# EAGLE schematic tc083-18 (EAGLE 6.6.0), part 1 of 2

## Sheet 1 of 12
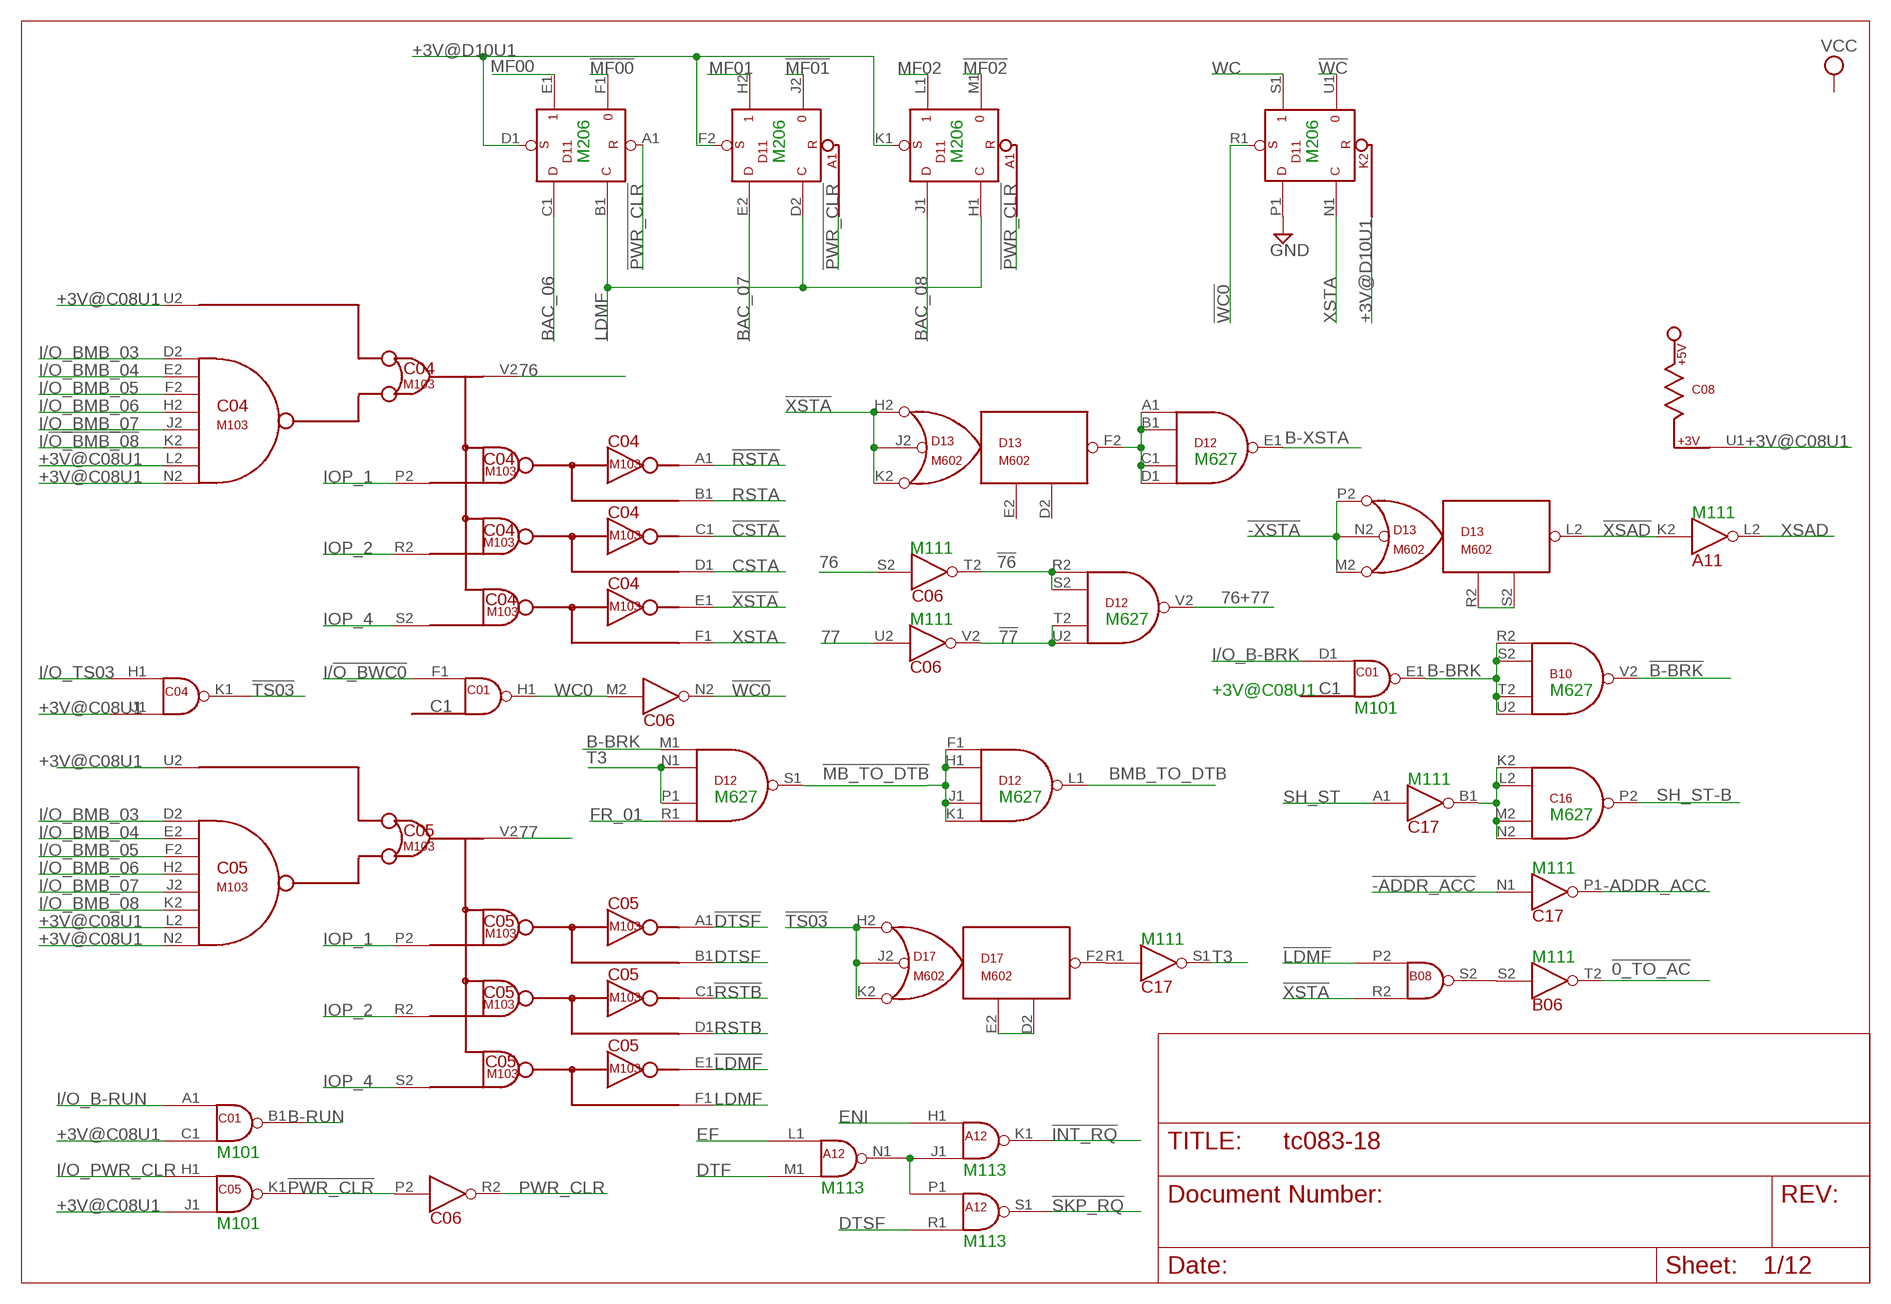
[diagram p0: schematic, sheet 1]

### Parts
A11  A11  M111  [H807]
A12  A12  M113  [H807]
B06  B06  M111  [H807]
B08  B08  M113  [H807]
B10  B10  M627  [H807]
C01  C01  M101  [H807]
C04  C04  M103  [H807]
C05  C05  M103  [H807]
C06  C06  M111  [H807]
C08  C08  M121  [H807]
C16  C16  M627  [H807]
C17  C17  M111  [H807]
D11  M206X  [H807]
D12  D12  M627  [H807]
D13  D13  M602  [H807]
D17  D17  M602  [H807]

### Nets
76: C04.V2 C06.S2(15:IN)
76+77: D12.V2(OUT) ; also sheet 11
77: C05.V2 C06.U2(16:IN)
!0_TO_AC: B06.T2(15:OUT) ; also sheet 11
!76: C06.T2(15:OUT) D12.R2(IN1) D12.S2(IN2)
!77: C06.V2(16:OUT) D12.T2(IN3) D12.U2(IN4)
!-ADDR_ACC: C17.N1(10:IN) ; also sheet 11
!-XSTA: D13.M2(K2) D13.N2(J2) D13.P2(H2)
!B-BRK: B10.V2(OUT) ; also sheet 11
!CSTA: C04.C1 ; also sheet 2
!DTSF: C05.A1
!INT_RQ: A12.K1(OUT) ; also sheet 11
!LDMF: B08.P2(IN1) C05.E1
!MB_TO_DTB: D12.F1(IN1) D12.H1(IN2) D12.J1(IN3) D12.K1(IN4) D12.S1(OUT)
!MF00: D11.F1 ; also sheet 11
!MF01: D11.J2 ; also sheet 11
!MF02: D11.M1 ; also sheet 11
!PWR_CLR: C05.K1(OUT) C06.P2(13:IN) D11.A1(A1:R) ; also sheet 2,4,5,6
!RSTA: C04.A1 ; also sheet 11
!RSTB: C05.C1 ; also sheet 11
!SKP_RQ: A12.S1(OUT) ; also sheet 11
!TS03: C04.K1(OUT) D17.H2 D17.J2 D17.K2
!WC: D11.U1 ; also sheet 4
!WC0: C06.N2(11:OUT) D11.R1(K2B:S)
!XSAD: A11.K2(9:IN) D13.L2(F2)
!XSTA: B08.R2(IN2) C04.E1 D13.H2 D13.J2 D13.K2 ; also sheet 3,6
+3V@C08U1: C01.C1(IN2) C04.J1(IN2) C04.L2 C04.N2 C04.U2 C05.J1(IN2) C05.L2 C05.N2 C05.U2 C08.U1 ; also sheet 11
+3V@D10U1: D11.D1(A1:S) D11.F2(A1B:S) D11.K1(A1C:S) ; also sheet 3,4
-ADDR_ACC: C17.P1(10:OUT)
B-BRK: B10.R2(IN1) B10.S2(IN2) B10.T2(IN3) B10.U2(IN4) C01.E1(OUT) D12.M1(IN1)
B-RUN: C01.B1(OUT) ; also sheet 2
B-XSTA: D12.E1(OUT) ; also sheet 4,6
BAC_06: D11.C1(A1:D) ; also sheet 2,10
BAC_07: D11.E2(A1B:D) ; also sheet 2,10
BAC_08: D11.J1(A1C:D) ; also sheet 2,10
BMB_TO_DTB: D12.L1(OUT) ; also sheet 8
CSTA: C04.D1 ; also sheet 6
DTF: A12.M1(IN2) ; also sheet 4,6,12
DTSF: A12.R1(IN2) C05.B1
EF: A12.L1(IN1) ; also sheet 6,12
ENI: A12.H1(IN1) ; also sheet 2,12
FR_01: D12.R1(IN4) ; also sheet 2,5,6,12
GND: D11.P1(K2B:D) ; also sheet 2,4,10,11,12
I/!O_BMB_08: C04.K2 ; also sheet 12
I/!O_BWC0: C01.F1(IN) ; also sheet 12
I/O_B-BRK: C01.D1(IN) ; also sheet 12
I/O_B-RUN: C01.A1(IN1) ; also sheet 12
I/O_BMB_03: C04.D2 C05.D2 ; also sheet 11,12
I/O_BMB_04: C04.E2 C05.E2 ; also sheet 11,12
I/O_BMB_05: C04.F2 C05.F2 ; also sheet 11,12
I/O_BMB_06: C04.H2 C05.H2 ; also sheet 11,12
I/O_BMB_07: C04.J2 C05.J2 ; also sheet 11,12
I/O_BMB_08: C05.K2 ; also sheet 11,12
I/O_PWR_CLR: C05.H1(IN1) ; also sheet 12
I/O_TS03: C04.H1(IN1) ; also sheet 12
IOP_1: C04.P2 C05.P2 ; also sheet 12
IOP_2: C04.R2 C05.R2 ; also sheet 12
IOP_4: C04.S2 C05.S2 ; also sheet 12
LDMF: C05.F1 D11.B1(A1:C) D11.D2(A1B:C) D11.H1(A1C:C)
MF00: D11.E1 ; also sheet 12
MF01: D11.H2 ; also sheet 12
MF02: D11.L1 ; also sheet 12
N$1: B06.S2(15:IN) B08.S2(OUT)
N$2: C16.K2(IN1) C16.L2(IN2) C16.M2(IN3) C16.N2(IN4) C17.B1(1:OUT)
N$4: D13.R2(E2) D13.S2(D2)
N$6: D12.A1(IN1) D12.B1(IN2) D12.C1(IN3) D12.D1(IN4) D13.F2
N$7: A12.J1(IN2) A12.N1(OUT) A12.P1(IN1)
N$8: C17.R1(12:IN) D17.F2
N$12: D17.D2 D17.E2
PWR_CLR: C06.R2(13:OUT)
RSTA: C04.B1
RSTB: C05.D1
SH_ST: C17.A1(1:IN) ; also sheet 7
SH_ST-B: C16.P2(OUT) ; also sheet 7
T3: C17.S1(12:OUT) D12.N1(IN2) D12.P1(IN3)
WC: D11.S1 ; also sheet 4,5,12
WC0: C01.H1(OUT) C06.M2(11:IN)
XSAD: A11.L2(9:OUT) ; also sheet 6
XSTA: C04.F1 D11.N1(K2B:C) ; also sheet 2
Unconnected: A12.U1 A12.V1 B06.M2(11:IN) B06.N2(11:OUT) B06.U2(16:IN) B06.V2(16:OUT) B08.U1 B10.K2(IN1) B10.L2(IN2) B10.M2(IN3) B10.N2(IN4) B10.P2(OUT) C01.E2(IN) C01.F2(OUT) C01.H2(IN) C01.J1(IN) C01.J2(OUT) C01.K1(OUT) C01.K2(IN) C01.L1(IN) C01.L2(OUT) C01.M1(OUT) C01.M2(IN) C01.N1(IN) C01.N2(OUT) C01.P1(OUT) C01.P2(IN) C01.R1(IN) C01.R2(OUT) C01.S1(OUT) C01.S2(IN) C01.T2(OUT) C01.U1(OUT) C01.U2(IN) C01.V1(IN) C01.V2(OUT) C04.L1(IN1) C04.M1(IN2) C04.N1(OUT) C05.L1(IN1) C05.M1(IN2) C05.N1(OUT) C08.V1 C17.D1(3:IN) C17.E1(3:OUT) C17.K2(9:IN) C17.L2(9:OUT) C17.U2(16:IN) C17.V2(16:OUT) D13.D2 D13.E2

### Notes on the sheet
- M206 | M206 | M206 | M206
- M627
- M111
- M111
- M111 | M627
- +3V@C08U1 | M627
- M101
- M111
- M627 | M627
- M627
- M111
- M111
- M111
- M101
- M113
- M113
- M101
- M113

## Sheet 2 of 12
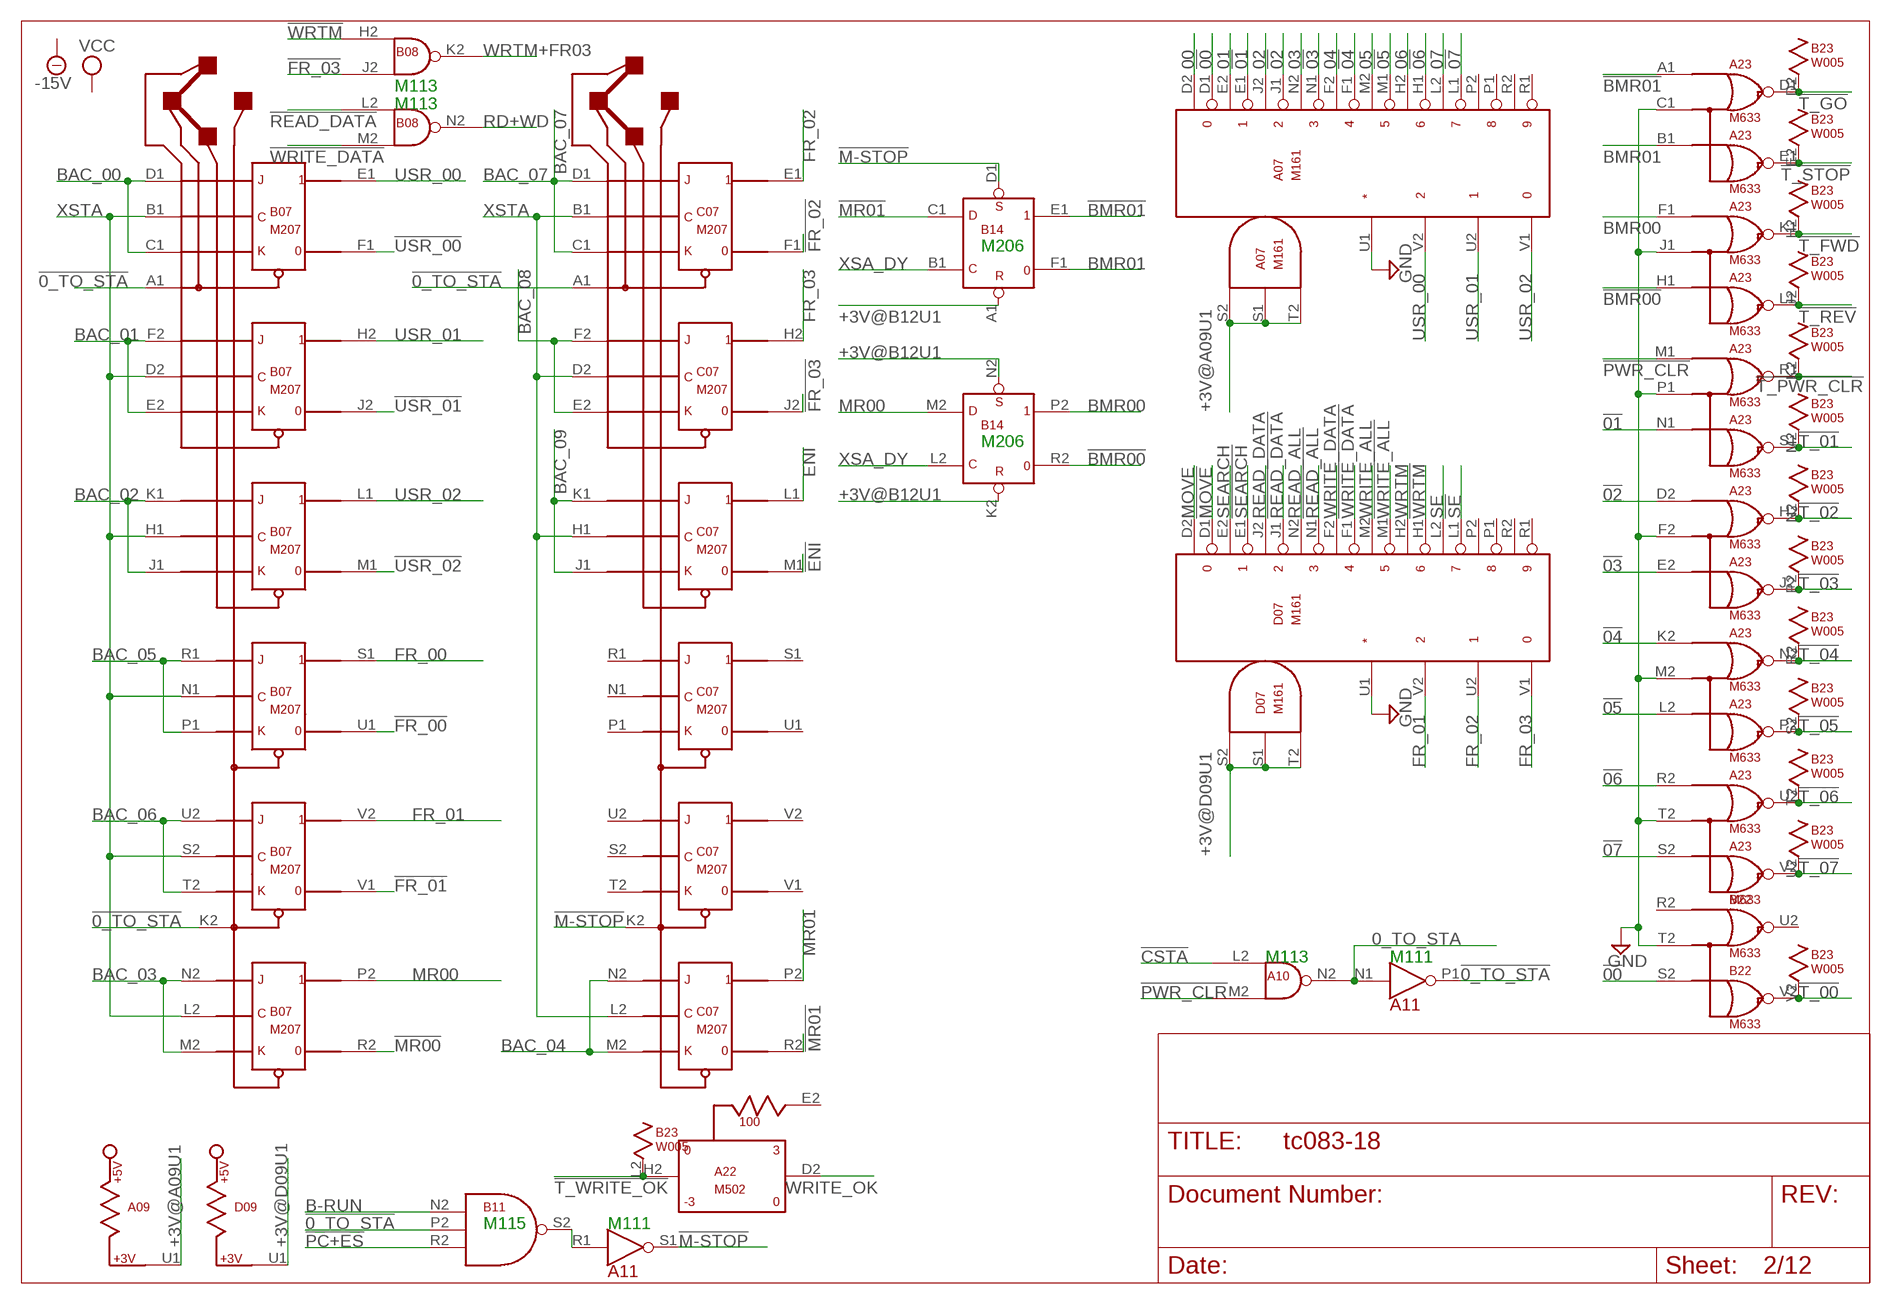
[diagram p1: schematic, sheet 2]

### Parts
A07  A07  M161  [H807]
A09  M117  [H807]
A10  M113  [H807]
A22  M502  [H807]
A23  M633  [H807]
B07  B07  M207  [H807]
B11  M115  [H807]
B14  M206X  [H807]
B22  M633  [H807]
B23  W005  [H807]
C07  B07  M207  [H807]
D07  D07  M161  [H807]
D09  M121  [H807]

### Nets
00: A07.D2(O0)
0_TO_STA: A10.N2(OUT) A11.N1(10:IN)
01: A07.E2(O1)
02: A07.J2(O2)
03: A07.N2(O3)
04: A07.F2(O4)
05: A07.M2(O5)
06: A07.H2(O6)
07: A07.L2(O7)
!00: A07.D1(!O0) B22.S2(B)
!0_TO_STA: A11.P1(10:OUT) B07.A1 B07.K2 B11.P2(IN2) C07.A1
!01: A07.E1(!O1) A23.N1(B)
!02: A07.J1(!O2) A23.D2(A)
!03: A07.N1(!O3) A23.E2(B)
!04: A07.F1(!O4) A23.K2(A)
!05: A07.M1(!O5) A23.L2(B)
!06: A07.H1(!O6) A23.R2(A)
!07: A07.L1(!O7) A23.S2(B)
!BMR00: A23.H1(B) B14.R2
!BMR01: A23.A1(A) B14.E1
!CSTA: A10.L2(IN1) ; also sheet 1
!ENI: C07.M1 ; also sheet 11
!FR_00: B07.U1 ; also sheet 4,11
!FR_01: B07.V1 ; also sheet 5,11
!FR_02: C07.F1 ; also sheet 11
!FR_03: B08.J2(IN2) C07.J2 ; also sheet 11
!M-STOP: A11.S1(12:OUT) B14.D1(A1:S) C07.K2 ; also sheet 3
!MOVE: D07.D1(!O0)
!MR00: B07.R2 ; also sheet 11
!MR01: B14.C1(A1:D) C07.R2 ; also sheet 11
!PC+ES: B11.R2(IN3) ; also sheet 6
!PWR_CLR: A10.M2(IN2) A23.M1(A) ; also sheet 1,4,5,6
!READ_ALL: D07.N1(!O3) ; also sheet 4
!READ_DATA: B08.L2(IN1) D07.J1(!O2) ; also sheet 5
!SE: D07.L1(!O7) ; also sheet 6
!SEARCH: D07.E1(!O1) ; also sheet 5,11
!T_00: B22.V2(E) B23.V2 ; also sheet 12
!T_01: A23.S1(E) B23.M2 ; also sheet 12
!T_02: A23.H2(D) B23.N2 ; also sheet 12
!T_03: A23.J2(E) B23.P2 ; also sheet 12
!T_04: A23.N2(D) B23.R2 ; also sheet 12
!T_05: A23.P2(E) B23.S2 ; also sheet 12
!T_06: A23.U2(D) B23.T2 ; also sheet 12
!T_07: A23.V2(E) B23.U2 ; also sheet 12
!T_FWD: A23.K1(D) B23.H2 ; also sheet 12
!T_GO: A23.D1(D) B23.D2 ; also sheet 12
!T_PWR_CLR: A23.R1(D) B23.K2 ; also sheet 12
!T_REV: A23.L1(E) B23.J2 ; also sheet 12
!T_STOP: A23.E1(E) B23.E2 ; also sheet 12
!T_WRITE_OK: A22.H2 B23.L2 ; also sheet 12
!USR_00: B07.F1 ; also sheet 11
!USR_01: B07.J2 ; also sheet 11
!USR_02: B07.M1 ; also sheet 11
!WRITE_ALL: D07.M1(!O5)
!WRITE_DATA: B08.M2(IN2) D07.F1(!O4)
!WRTM: B08.H2(IN1) D07.H1(!O6)
+3V@A09U1: A07.S1(EN2) A07.S2(EN1) A07.T2(EN3) A09.U1 ; also sheet 4,6
+3V@B12U1: B14.A1(A1:R) B14.K2(K2:R) B14.N2(K2:S) ; also sheet 3,4
+3V@D09U1: D07.S1(EN2) D07.S2(EN1) D07.T2(EN3) D09.U1
B-RUN: B11.N2(IN1) ; also sheet 1
BAC_00: B07.C1 B07.D1 ; also sheet 10
BAC_01: B07.E2 B07.F2 ; also sheet 10
BAC_02: B07.J1 B07.K1 ; also sheet 10
BAC_03: B07.M2 B07.N2 ; also sheet 10
BAC_04: C07.M2 C07.N2 ; also sheet 10
BAC_05: B07.P1 B07.R1 ; also sheet 10
BAC_06: B07.T2 B07.U2 ; also sheet 1,10
BAC_07: C07.C1 C07.D1 ; also sheet 1,10
BAC_08: C07.E2 C07.F2 ; also sheet 1,10
BAC_09: C07.J1 C07.K1 ; also sheet 10
BMR00: A23.F1(A) B14.P2
BMR01: A23.B1(B) B14.F1
ENI: C07.L1 ; also sheet 1,12
FR_00: B07.S1 ; also sheet 4,12
FR_01: B07.V2 D07.V2(IN2) ; also sheet 1,5,6,12
FR_02: C07.E1 D07.U2(IN1) ; also sheet 12
FR_03: C07.H2 D07.V1(IN0) ; also sheet 5,12
GND: A07.U1(IN*) A23.C1(C) A23.F2(C) A23.J1(C) A23.M2(C) A23.P1(C) A23.T2(C) B22.T2(C) D07.U1(IN*) ; also sheet 1,4,10,11,12
MOVE: D07.D2(O0)
MR00: B07.P2 B14.M2(K2:D) ; also sheet 12
MR01: C07.P2 ; also sheet 3,12
N$3: A11.R1(12:IN) B11.S2(OUT)
RD+WD: B08.N2(OUT) ; also sheet 4,6
READ_ALL: D07.N2(O3)
READ_DATA: D07.J2(O2) ; also sheet 4,6
SE: D07.L2(O7)
SEARCH: D07.E2(O1) ; also sheet 4
USR_00: A07.V2(IN2) B07.E1 ; also sheet 12
USR_01: A07.U2(IN1) B07.H2 ; also sheet 12
USR_02: A07.V1(IN0) B07.L1 ; also sheet 12
WRITE_ALL: D07.M2(O5) ; also sheet 4,5
WRITE_DATA: D07.F2(O4) ; also sheet 5,9
WRITE_OK: A22.D2 ; also sheet 5,6
WRTM: D07.H2(O6) ; also sheet 3,5,6
WRTM+FR03: B08.K2(OUT) ; also sheet 4
XSA_DY: B14.B1(A1:C) B14.L2(K2:C) ; also sheet 6
XSTA: B07.B1 B07.D2 B07.H1 B07.L2 B07.N1 B07.S2 C07.B1 C07.D2 C07.H1 C07.L2 ; also sheet 1
Unconnected: A07.P1(!O8) A07.P2(O8) A07.R1(!O9) A07.R2(O9) A09.V1 A10.U1 A10.V1 A22.E2 A22.P2(E2) A22.R2(D2) A22.U2(H2) B14.D2(A1B:C) B14.E2(A1B:D) B14.F2(A1B:S) B14.H1(A1C:C) B14.H2 B14.J1(A1C:D) B14.J2 B14.K1(A1C:S) B14.L1 B14.M1 B22.A1(A) B22.B1(B) B22.C1(C) B22.D1(D) B22.D2(A) B22.E1(E) B22.E2(B) B22.F1(A) B22.F2(C) B22.H1(B) B22.H2(D) B22.J1(C) B22.J2(E) B22.K1(D) B22.K2(A) B22.L1(E) B22.L2(B) B22.M1(A) B22.M2(C) B22.N1(B) B22.N2(D) B22.P1(C) B22.P2(E) B22.R1(D) B22.R2(A) B22.S1(E) B22.U2(D) B23.F2 C07.N1 C07.P1 C07.R1 C07.S1 C07.S2 C07.T2 C07.U1 C07.U2 C07.V1 C07.V2 D07.P1(!O8) D07.P2(O8) D07.R1(!O9) D07.R2(O9) D09.V1

### Notes on the sheet
- M113
- M113
- M206
- M206
- M113 | M111
- M115 | M111

## Sheet 3 of 12
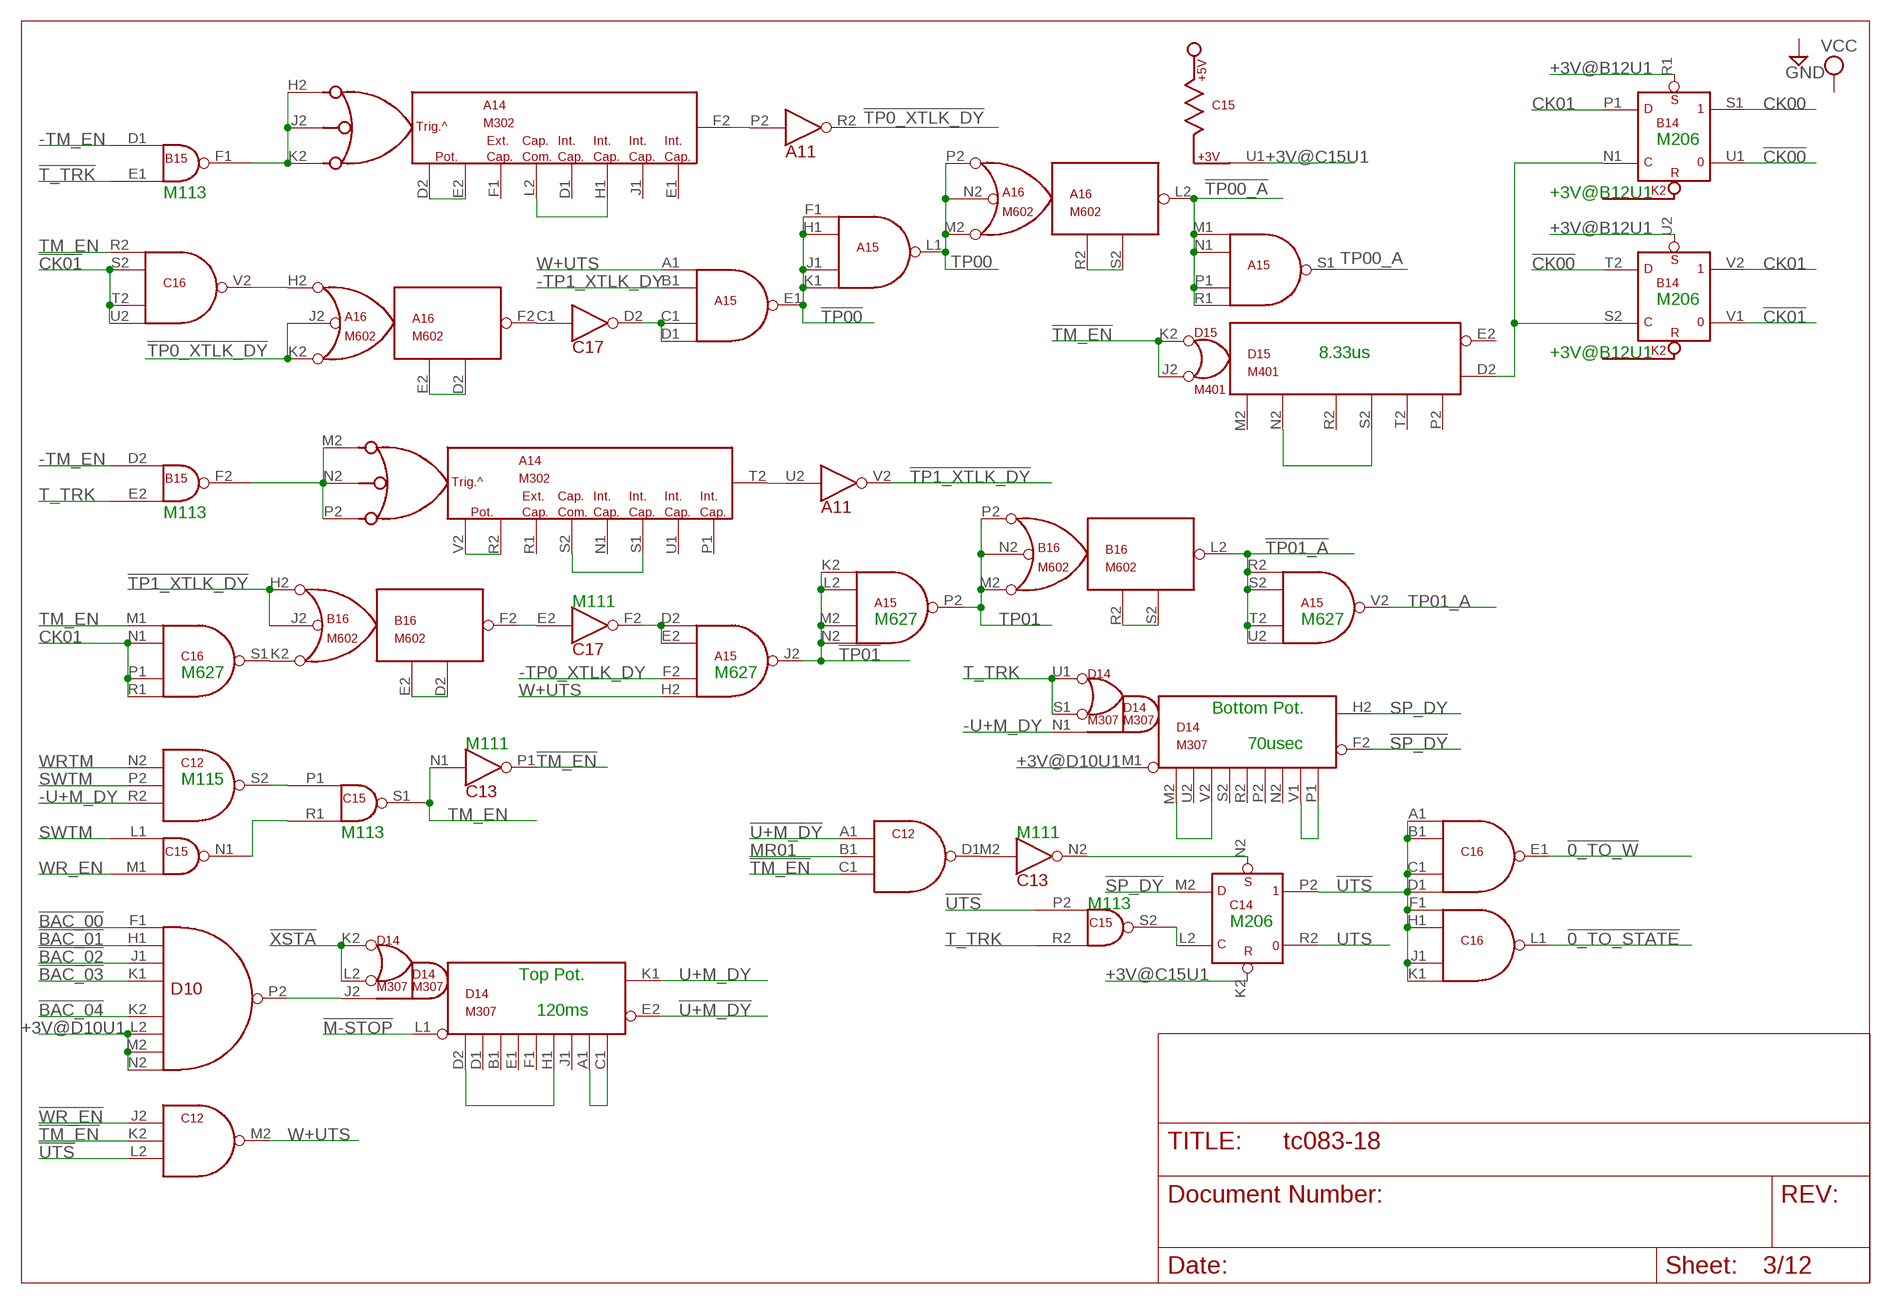
[diagram p2: schematic, sheet 3]

### Parts
A14  M302  [H807]
A15  M627  [H807]
A16  M602  [H807]
B15  M113  [H807]
B16  M602  [H807]
C12  M115  [H807]
C13  M111  [H807]
C14  M206X  [H807]
C15  M113  [H807]
D10  M119  [H807]
D14  M307  [H807]
D15  M401  [H807]

### Nets
!0_TO_STATE: C16.L1(OUT) ; also sheet 7
!0_TO_W: C16.E1(OUT) ; also sheet 7
!BAC_00: D10.F1(IN1) ; also sheet 10,11
!BAC_01: D10.H1(IN2) ; also sheet 10,11
!BAC_02: D10.J1(IN3) ; also sheet 10,11
!BAC_03: D10.K1(IN4) ; also sheet 10,11
!BAC_04: D10.K2(IN5) ; also sheet 10,11
!CK00: B14.T2(K2C:D) B14.U1 ; also sheet 10
!CK01: B14.V1 C16.S2(IN2) C16.T2(IN3) C16.U2(IN4)
!M-STOP: D14.L1(M1) ; also sheet 2
!SP_DY: C14.M2(K2:D) D14.F2
!T_TRK: B15.E1(IN2) ; also sheet 10
!TM_EN: C12.C1(IN3) C12.K2(IN2) C13.P1(10:OUT) D15.J2 D15.K2
!TP00: A15.E1(OUT) A15.F1(IN1) A15.H1(IN2) A15.J1(IN3) A15.K1(IN4) ; also sheet 7
!TP00_A: A15.M1(IN1) A15.N1(IN2) A15.P1(IN3) A15.R1(IN4) A16.L2(F2)
!TP0_XTLK_DY: A11.R2(13:OUT) A16.J2 A16.K2
!TP01: A15.J2(OUT) A15.K2(IN1) A15.L2(IN2) A15.M2(IN3) A15.N2(IN4)
!TP01_A: A15.R2(IN1) A15.S2(IN2) A15.T2(IN3) A15.U2(IN4) B16.L2(F2)
!TP1_XTLK_DY: A11.V2(16:OUT) B16.H2 B16.J2
!U+M_DY: C12.A1(IN1) D14.E2(F2)
!UTS: C12.L2(IN3) C14.P2 C15.P2(IN1) C16.A1(IN1) C16.B1(IN2) C16.C1(IN3) C16.D1(IN4) C16.F1(IN1) C16.H1(IN2) C16.J1(IN3) C16.K1(IN4)
!WR_EN: C12.J2(IN1) ; also sheet 5,9
!XSTA: D14.K2(U1) D14.L2(S1) ; also sheet 1,6
+3V@B12U1: B14.R1(K2B:S) B14.U2(K2C:S) ; also sheet 2,4
+3V@C15U1: C14.K2(K2:R) C15.U1 ; also sheet 5,8
+3V@D10U1: D10.L2(IN6) D10.M2(IN7) D10.N2(IN8) D14.M1 ; also sheet 1,4
-TM_EN: B15.D1(IN1) B15.D2(IN1)
-TP0_XTLK_DY: A15.F2(IN3)
-TP1_XTLK_DY: A15.B1(IN2)
-U+M_DY: C12.R2(IN3) D14.N1
CK00: B14.S1 ; also sheet 10
CK01: B14.P1(K2B:D) B14.V2 C16.N1(IN2) C16.P1(IN3) C16.R1(IN4)
MR01: C12.B1(IN2) ; also sheet 2,12
N$5: A16.H2 C16.V2(OUT)
N$13: A14.H2 A14.J2 A14.K2 B15.F1(OUT)
N$14: A16.D2 A16.E2
N$15: A16.F2 C17.C1(2:IN)
N$16: A15.C1(IN3) A15.D1(IN4) C17.D2(2:OUT)
N$17: B14.N1(K2B:C) B14.S2(K2C:C) D15.D2
N$18: A14.M2(H2) A14.N2(J2) A14.P2(K2) B15.F2(OUT)
N$19: A14.H1 A14.L2
N$20: A16.R2(E2) A16.S2(D2)
N$21: A14.D2 A14.E2
N$22: A11.U2(16:IN) A14.T2(F2)
N$23: A11.P2(13:IN) A14.F2
N$24: B16.K2 C16.S1(OUT)
N$25: A14.R2(E2) A14.V2(D2)
N$26: A14.S1(H1) A14.S2(L2)
N$27: D15.N2 D15.S2
N$29: B16.D2 B16.E2
N$30: B16.F2 C17.E2(5:IN)
N$31: A15.D2(IN1) A15.E2(IN2) C17.F2(5:OUT)
N$37: B16.R2(E2) B16.S2(D2)
N$40: D14.M2 D14.V2
N$41: D14.P1 D14.V1
N$50: C12.S2(OUT) C15.P1(IN1)
N$53: C15.N1(OUT) C15.R1(IN2)
N$67: D10.P2(OUT) D14.J2(N1)
N$68: D14.D2(M2) D14.H1(P2)
N$69: D14.A1(V1) D14.C1(P1)
N$76: C14.L2(K2:C) C15.S2(OUT)
N$79: C13.N2(11:OUT) C14.N2(K2:S)
N$81: C12.D1(OUT) C13.M2(11:IN)
SP_DY: D14.H2
SWTM: C12.P2(IN2) C15.L1(IN1) ; also sheet 5,6,12
T_TRK: B15.E2(IN2) C15.R2(IN2) D14.S1 D14.U1 ; also sheet 10
TM_EN: C13.N1(10:IN) C15.S1(OUT) C16.M1(IN1) C16.R2(IN1) ; also sheet 10
TP00: A15.L1(OUT) A16.M2(K2) A16.N2(J2) A16.P2(H2) ; also sheet 4,5,6
TP00_A: A15.S1(OUT) ; also sheet 5,9
TP01: A15.P2(OUT) B16.M2(K2) B16.N2(J2) B16.P2(H2) ; also sheet 5,7,9
TP01_A: A15.V2(OUT) ; also sheet 4,9
U+M_DY: D14.K1(H2)
UTS: C14.R2 ; also sheet 5,12
W+UTS: A15.A1(IN1) A15.H2(IN4) C12.M2(OUT)
WR_EN: C15.M1(IN2) ; also sheet 5,9,10,12
WRTM: C12.N2(IN1) ; also sheet 2,5,6
Unconnected: A14.D1 A14.E1 A14.F1 A14.J1 A14.N1(D1) A14.P1(E1) A14.R1(F1) A14.U1(J1) B15.A1(IN1) B15.B1(IN2) B15.C1(OUT) B15.H2(IN1) B15.J2(IN2) B15.K2(OUT) B15.L2(IN1) B15.M2(IN2) B15.N2(OUT) B15.T2(IN1) B15.U1 B15.U2(IN2) B15.V1 B15.V2(OUT) C13.U2(16:IN) C13.V2(16:OUT) C14.S2(K2C:C) C14.T2(K2C:D) C14.U2(K2C:S) C14.V1 C14.V2 C15.T2(IN1) C15.U2(IN2) C15.V1 C15.V2(OUT) D10.V1 D14.B1(V2) D14.D1(U2) D14.E1(S2) D14.F1(R2) D14.J1(N2) D14.N2 D14.P2 D14.R2 D14.S2 D14.U2 D15.E2 D15.M2 D15.P2 D15.R2 D15.T2

### Notes on the sheet
- M206
- M113 | +3V@B12U1
- M206
- 8.33us | +3V@B12U1
- M113
- M111
- M627 | M627
- M627 | M627
- Bottom Pot.
- M111 | 70usec
- M115
- M113 | M111
- M113
- M206
- Top Pot.
- 120ms

## Sheet 4 of 12
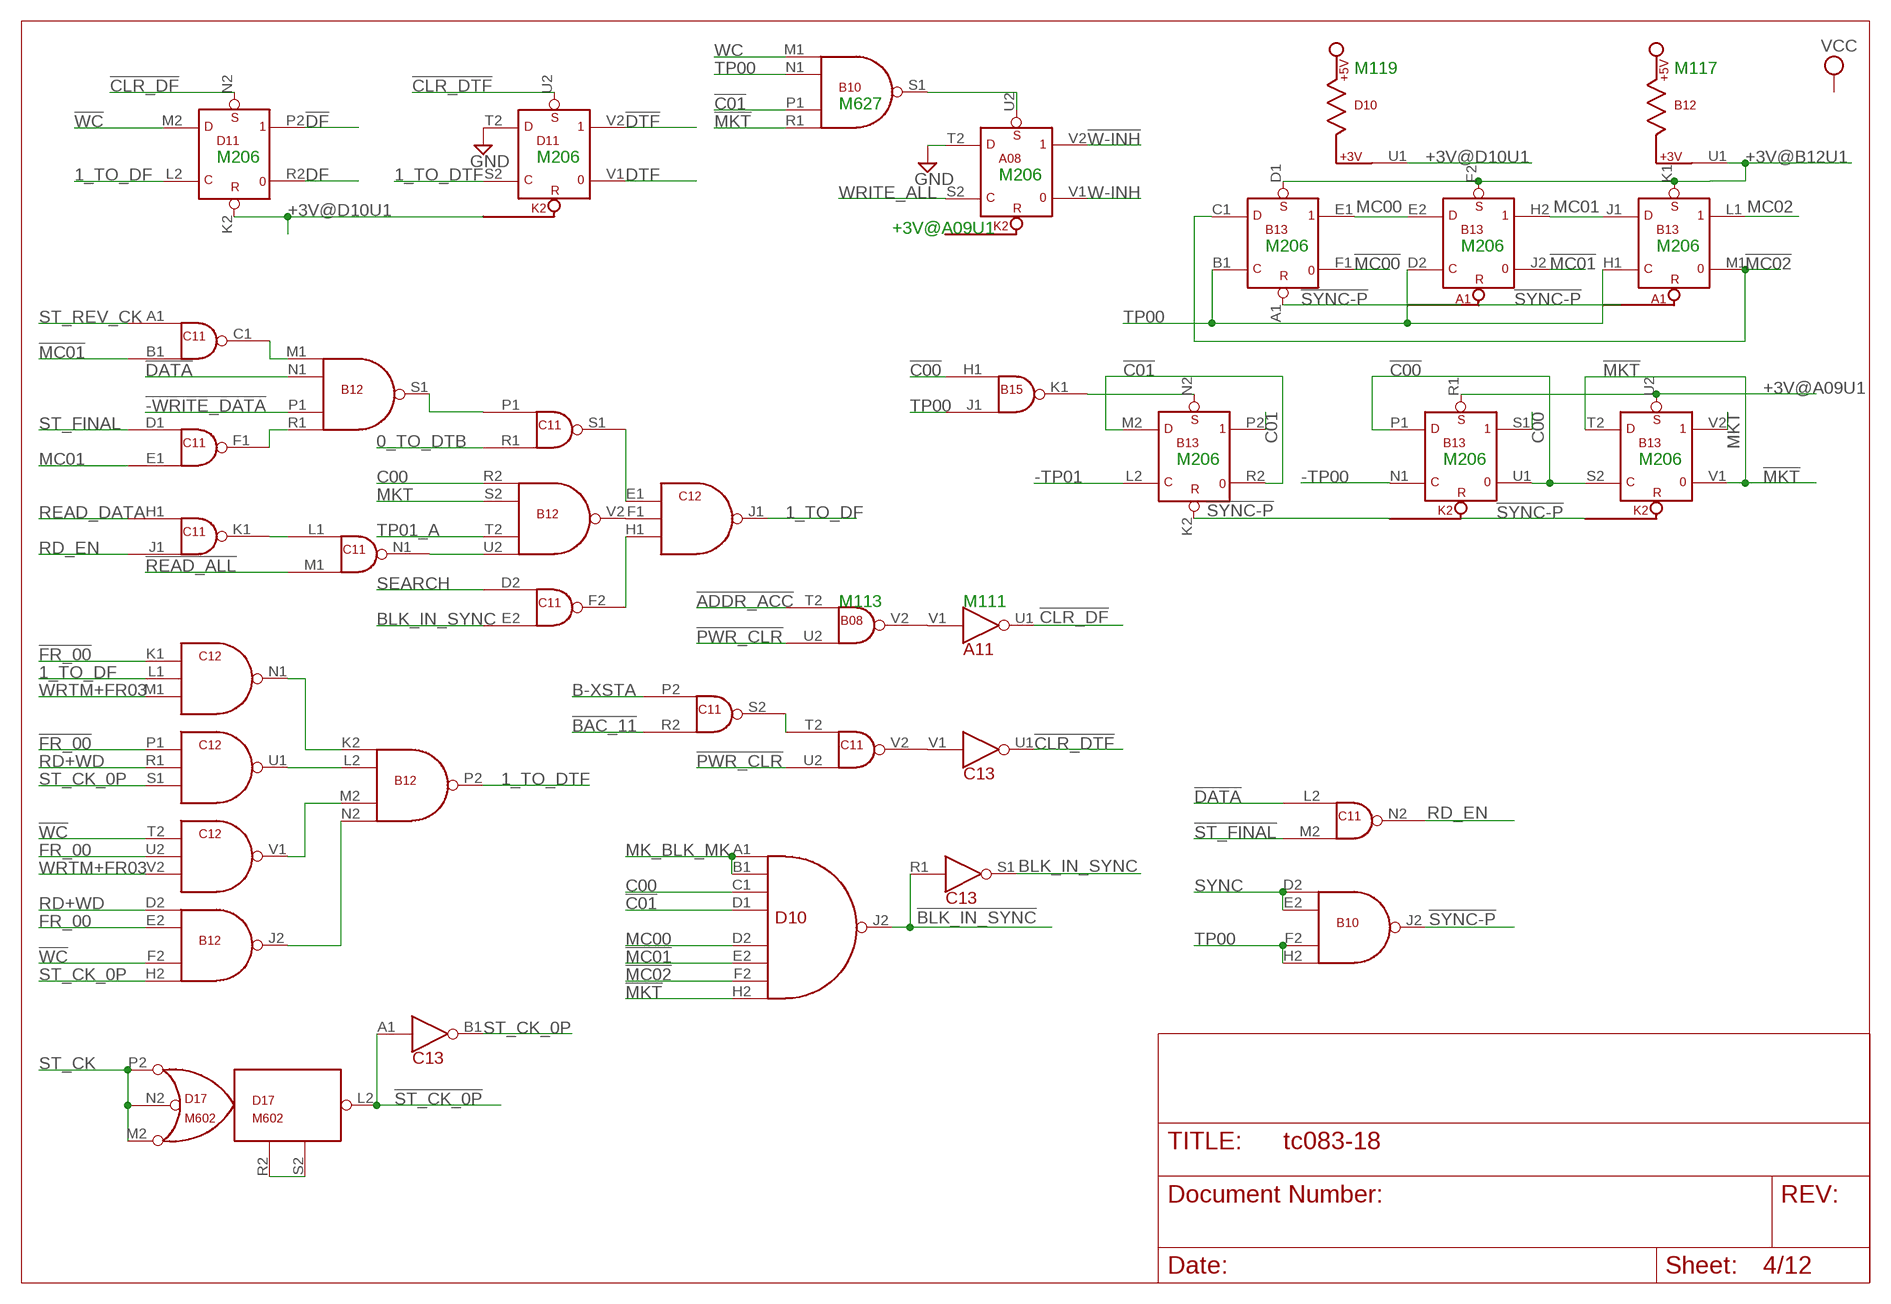
[diagram p3: schematic, sheet 4]

### Parts
A08  M206X  [H807]
B12  M117  [H807]
B13  M206X  [H807]
C11  M113  [H807]

### Nets
0_TO_DTB: C11.R1(IN2) ; also sheet 5
1_TO_DF: C12.J1(OUT) C12.L1(IN2) D11.L2(K2:C) ; also sheet 6
1_TO_DTF: B12.P2(OUT) D11.S2(K2C:C)
!-WRITE_DATA: B12.P1(IN3)
!ADDR_ACC: B08.T2(IN1)
!BAC_11: C11.R2(IN2) ; also sheet 10,11
!BLK_IN_SYNC: C13.R1(12:IN) D10.J2(OUT) ; also sheet 5
!C00: B13.P1(K2B:D) B13.S2(K2C:C) B13.U1 B15.H1(IN1) ; also sheet 5,9
!C01: B10.P1(IN3) B13.M2(K2:D) B13.R2 D10.D1(IN4) ; also sheet 5,9
!CLR_DF: A11.U1(14:OUT) D11.N2(K2:S)
!CLR_DTF: C13.U1(14:OUT) D11.U2(K2C:S)
!DATA: B12.N1(IN2) C11.L2(IN1) ; also sheet 5
!DF: D11.P2 ; also sheet 5,11
!DTF: D11.V2 ; also sheet 5,11
!FR_00: C12.K1(IN1) C12.P1(IN1) ; also sheet 2,11
!MC00: B13.F1 ; also sheet 5,6
!MC01: B13.J2 C11.B1(IN2) D10.E2(IN6) ; also sheet 5
!MC02: B13.C1(A1:D) B13.M1 D10.F2(IN7)
!MKT: B10.R1(IN4) B13.T2(K2C:D) B13.V1 D10.H2(IN8) ; also sheet 5
!PWR_CLR: B08.U2(IN2) C11.U2(IN2) ; also sheet 1,2,5,6
!READ_ALL: C11.M1(IN2) ; also sheet 2
!ST_CK_0P: C13.A1(1:IN) D17.L2(F2)
!ST_FINAL: C11.M2(IN2) ; also sheet 5
!SYNC-P: B10.J2(OUT) B13.A1(A1:R) B13.K2(K2:R)
!W-INH: A08.V2 ; also sheet 5
!WC: B12.F2(IN3) C12.T2(IN1) D11.M2(K2:D) ; also sheet 1
+3V@A09U1: B13.R1(K2B:S) B13.U2(K2C:S) ; also sheet 2,6
+3V@B12U1: B12.U1 B13.D1(A1:S) B13.F2(A1B:S) B13.K1(A1C:S) ; also sheet 2,3
+3V@D10U1: D10.U1 D11.K2(K2:R) ; also sheet 1,3
-TP00: B13.N1(K2B:C)
-TP01: B13.L2(K2:C)
B-XSTA: C11.P2(IN1) ; also sheet 1,6
BLK_IN_SYNC: C11.E2(IN2) C13.S1(12:OUT) ; also sheet 7
C00: B12.R2(IN1) B13.S1 D10.C1(IN3) ; also sheet 5,9,12
C01: B13.P2 ; also sheet 5,12
DF: D11.R2 ; also sheet 6,12
DTF: D11.V1 ; also sheet 1,6,12
FR_00: B12.E2(IN2) C12.U2(IN2) ; also sheet 2,12
GND: A08.T2(K2C:D) D11.T2(K2C:D) ; also sheet 1,2,10,11,12
MC00: B13.E1 B13.E2(A1B:D) D10.D2(IN5) ; also sheet 12
MC01: B13.H2 B13.J1(A1C:D) C11.E1(IN2) ; also sheet 6,12
MC02: B13.L1 ; also sheet 5,9,12
MK_BLK_MK: D10.A1(IN1) D10.B1(IN2) ; also sheet 7
MKT: B12.S2(IN2) B13.V2 ; also sheet 5,9,12
N$10: B12.M1(IN1) C11.C1(OUT)
N$11: B12.R1(IN4) C11.F1(OUT)
N$28: B12.L2(IN2) C12.U1(OUT)
N$33: A08.U2(K2C:S) B10.S1(OUT)
N$42: C11.K1(OUT) C11.L1(IN1)
N$44: B12.U2(IN4) C11.N1(OUT)
N$48: B12.S1(OUT) C11.P1(IN1)
N$51: B12.V2(OUT) C12.F1(IN2)
N$52: C11.S1(OUT) C12.E1(IN1)
N$54: C11.F2(OUT) C12.H1(IN3)
N$58: A11.V1(14:IN) B08.V2(OUT)
N$59: C11.V2(OUT) C13.V1(14:IN)
N$60: B12.K2(IN1) C12.N1(OUT)
N$61: B12.M2(IN3) C12.V1(OUT)
N$62: B12.J2(OUT) B12.N2(IN4)
N$63: B13.N2(K2:S) B15.K1(OUT)
N$65: C11.S2(OUT) C11.T2(IN1)
N$88: D17.R2(E2) D17.S2(D2)
RD+WD: B12.D2(IN1) C12.R1(IN2) ; also sheet 2,6
RD_EN: C11.J1(IN2) C11.N2(OUT)
READ_DATA: C11.H1(IN1) ; also sheet 2,6
SEARCH: C11.D2(IN1) ; also sheet 2
ST_CK: D17.M2(K2) D17.N2(J2) D17.P2(H2) ; also sheet 5,6,7,12
ST_CK_0P: B12.H2(IN4) C12.S1(IN3) C13.B1(1:OUT)
ST_FINAL: C11.D1(IN1) ; also sheet 5,7,9,12
ST_REV_CK: C11.A1(IN1) ; also sheet 5,7,9,12
SYNC: B10.D2(IN1) B10.E2(IN2) ; also sheet 7
TP00: B10.F2(IN3) B10.H2(IN4) B10.N1(IN2) B13.B1(A1:C) B13.D2(A1B:C) B13.H1(A1C:C) B15.J1(IN2) ; also sheet 3,5,6
TP01_A: B12.T2(IN3) ; also sheet 3,9
W-INH: A08.V1
WC: B10.M1(IN1) ; also sheet 1,5,12
WRITE_ALL: A08.S2(K2C:C) ; also sheet 2,5
WRTM+FR03: C12.M1(IN3) C12.V2(IN3) ; also sheet 2
Unconnected: B12.V1 C11.U1 C11.V1

### Notes on the sheet
- M119 | M117
- M627
- M206 | M206
- M206
- +3V@A09U1
- M206 | M206 | M206
- M206 | M206 | M206
- M113 | M111

## Sheet 5 of 12
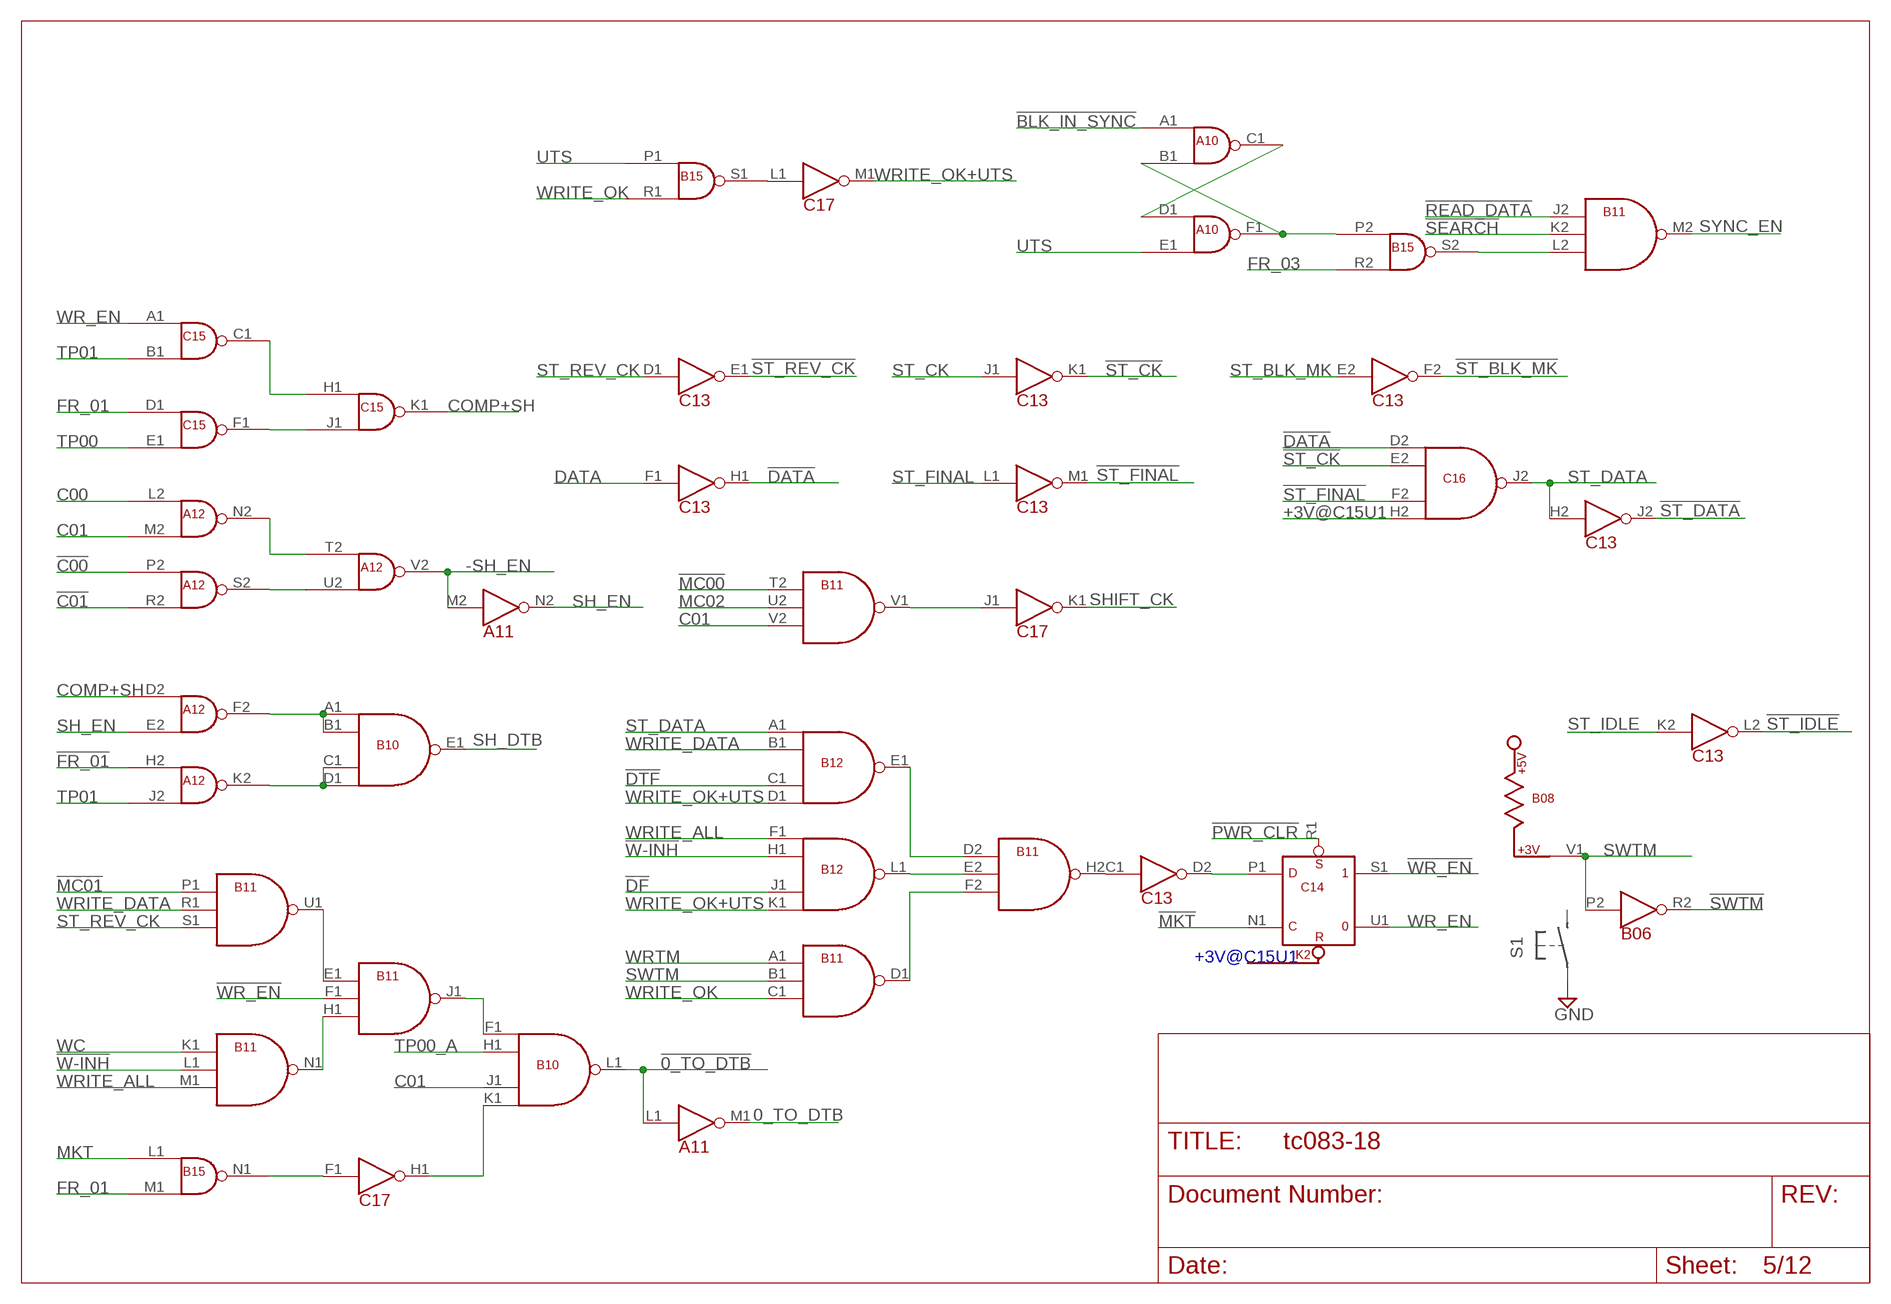
[diagram p4: schematic, sheet 5]

### Nets
0_TO_DTB: A11.M1(8:OUT) ; also sheet 4
!0_TO_DTB: A11.L1(8:IN) B10.L1(OUT) ; also sheet 8
!BLK_IN_SYNC: A10.A1(IN1) ; also sheet 4
!C00: A12.P2(IN1) ; also sheet 4,9
!C01: A12.R2(IN2) ; also sheet 4,9
!DATA: C13.H1(4:OUT) C16.D2(IN1) ; also sheet 4
!DF: B12.J1(IN3) ; also sheet 4,11
!DTF: B12.C1(IN3) ; also sheet 4,11
!FR_01: A12.H2(IN1) ; also sheet 2,11
!MC00: B11.T2(IN1) ; also sheet 4,6
!MC01: B11.P1(IN1) ; also sheet 4
!MKT: C14.N1(K2B:C) ; also sheet 4
!PWR_CLR: C14.R1(K2B:S) ; also sheet 1,2,4,6
!READ_DATA: B11.J2(IN1) ; also sheet 2
!SEARCH: B11.K2(IN2) ; also sheet 2,11
!ST_BLK_MK: C13.F2(5:OUT) ; also sheet 6
!ST_CK: C13.K1(6:OUT) C16.E2(IN2)
!ST_DATA: C13.J2(7:OUT)
!ST_FINAL: C13.M1(8:OUT) C16.F2(IN3) ; also sheet 4
!ST_IDLE: C13.L2(9:OUT) ; also sheet 6
!ST_REV_CK: C13.E1(3:OUT)
!SWTM: B06.R2(13:OUT)
!W-INH: B11.L1(IN2) B12.H1(IN2) ; also sheet 4
!WR_EN: B11.F1(IN2) C14.S1 ; also sheet 3,9
+3V@C15U1: C16.H2(IN4) ; also sheet 3,8
-SH_EN: A11.M2(11:IN) A12.V2(OUT) ; also sheet 8
C00: A12.L2(IN1) ; also sheet 4,9,12
C01: A12.M2(IN2) B10.J1(IN3) B11.V2(IN3) ; also sheet 4,12
COMP+SH: A12.D2(IN1) C15.K1(OUT) ; also sheet 8
DATA: C13.F1(4:IN) ; also sheet 7,12
FR_01: B15.M1(IN2) C15.D1(IN1) ; also sheet 1,2,6,12
FR_03: B15.R2(IN2) ; also sheet 2,12
MC02: B11.U2(IN2) ; also sheet 4,9,12
MKT: B15.L1(IN1) ; also sheet 4,9,12
N$32: B15.S1(OUT) C17.L1(8:IN)
N$36: C13.D2(2:OUT) C14.P1(K2B:D)
N$38: C15.C1(OUT) C15.H1(IN1)
N$39: C15.F1(OUT) C15.J1(IN2)
N$43: A12.N2(OUT) A12.T2(IN1)
N$45: A12.S2(OUT) A12.U2(IN2)
N$47: B11.H2(OUT) C13.C1(2:IN)
N$49: B11.E2(IN2) B12.L1(OUT)
N$55: B11.D2(IN1) B12.E1(OUT)
N$56: B11.D1(OUT) B11.F2(IN3)
N$64: A12.K2(OUT) B10.C1(IN3) B10.D1(IN4)
N$66: A12.F2(OUT) B10.A1(IN1) B10.B1(IN2)
N$70: B11.E1(IN1) B11.U1(OUT)
N$71: B15.N1(OUT) C17.F1(4:IN)
N$72: B11.H1(IN3) B11.N1(OUT)
N$77: B10.F1(IN1) B11.J1(OUT)
N$78: B10.K1(IN4) C17.H1(4:OUT)
N$82: B11.V1(OUT) C17.J1(6:IN)
N$84: A10.C1(OUT) A10.D1(IN1)
N$85: A10.B1(IN2) A10.F1(OUT) B15.P2(IN1)
N$86: B11.L2(IN3) B15.S2(OUT)
SH_DTB: B10.E1(OUT) ; also sheet 6,8
SH_EN: A11.N2(11:OUT) A12.E2(IN2) ; also sheet 8
SHIFT_CK: C17.K1(6:OUT) ; also sheet 7
ST_BLK_MK: C13.E2(5:IN) ; also sheet 7,12
ST_CK: C13.J1(6:IN) ; also sheet 4,6,7,12
ST_DATA: B12.A1(IN1) C13.H2(7:IN) C16.J2(OUT)
ST_FINAL: C13.L1(8:IN) ; also sheet 4,7,9,12
ST_IDLE: C13.K2(9:IN) ; also sheet 7,12
ST_REV_CK: B11.S1(IN3) C13.D1(3:IN) ; also sheet 4,7,9,12
SWTM: B06.P2(13:IN) B08.V1 B11.B1(IN2) ; also sheet 3,6,12
SYNC_EN: B11.M2(OUT)
TP00: C15.E1(IN2) ; also sheet 3,4,6
TP00_A: B10.H1(IN2) ; also sheet 3,9
TP01: A12.J2(IN2) C15.B1(IN2) ; also sheet 3,7,9
UTS: A10.E1(IN2) B15.P1(IN1) ; also sheet 3,12
WC: B11.K1(IN1) ; also sheet 1,4,12
WR_EN: C14.U1 C15.A1(IN1) ; also sheet 3,9,10,12
WRITE_ALL: B11.M1(IN3) B12.F1(IN1) ; also sheet 2,4
WRITE_DATA: B11.R1(IN2) B12.B1(IN2) ; also sheet 2,9
WRITE_OK: B11.C1(IN3) B15.R1(IN2) ; also sheet 2,6
WRITE_OK+UTS: B12.D1(IN4) B12.K1(IN4) C17.M1(8:OUT)
WRTM: B11.A1(IN1) ; also sheet 2,3,6

### Notes on the sheet
- +3V@C15U1

## Sheet 6 of 12
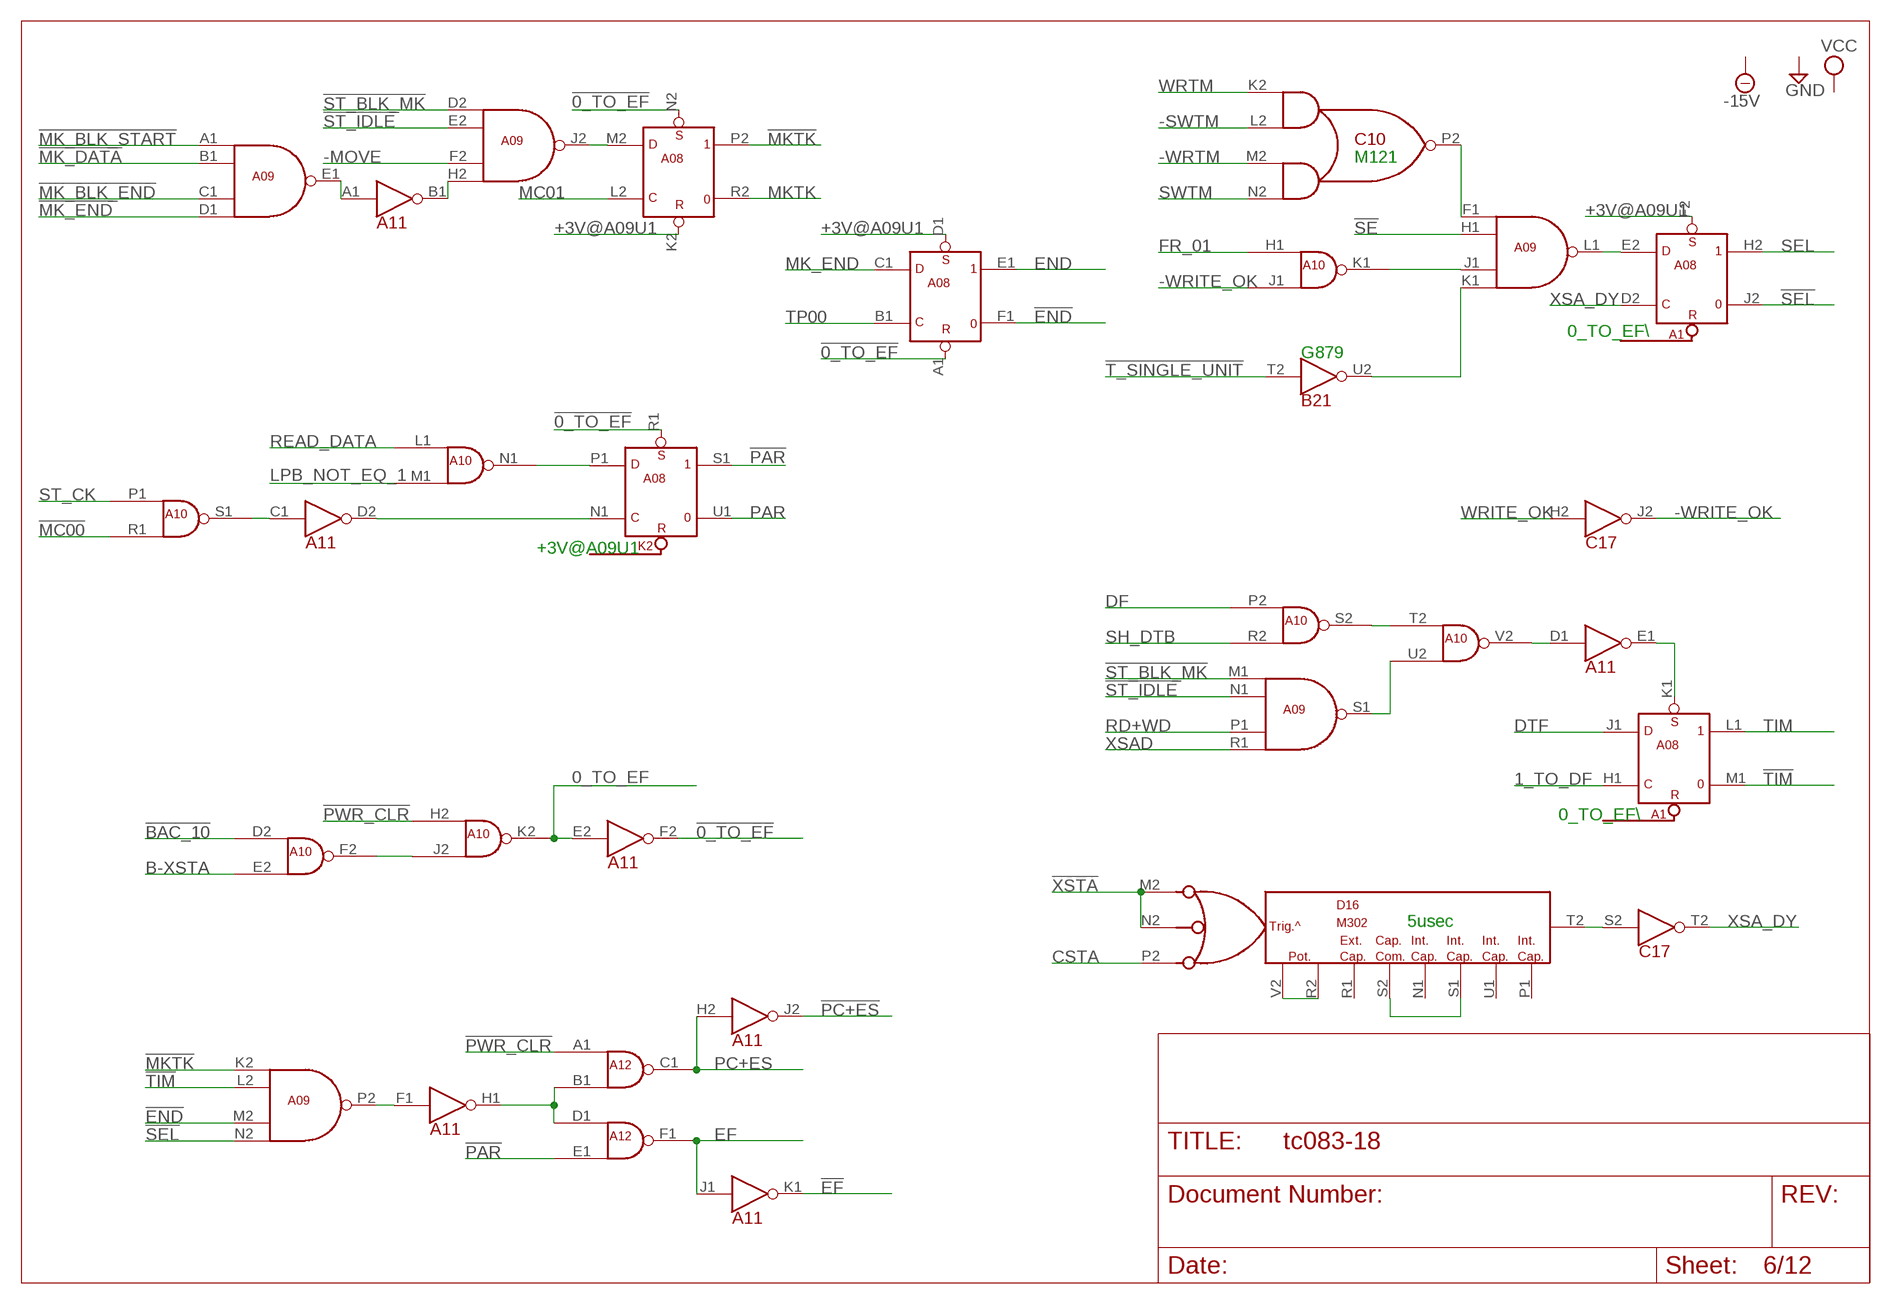
[diagram p5: schematic, sheet 6]

### Parts
B21  G879  [H807]
C10  M121  [H807]
D16  M302  [H807]

### Nets
0_TO_EF: A10.K2(OUT) A11.E2(5:IN)
1_TO_DF: A08.H1(A1C:C) ; also sheet 4
!0_TO_EF: A08.A1(A1:R) A08.N2(K2:S) A08.R1(K2B:S) A11.F2(5:OUT)
!BAC_10: A10.D2(IN1) ; also sheet 10,11
!EF: A11.K1(6:OUT) ; also sheet 11
!END: A08.F1 A09.M2(IN3) ; also sheet 11
!MC00: A10.R1(IN2) ; also sheet 4,5
!MK_BLK_END: A09.C1(IN3) ; also sheet 7
!MK_BLK_START: A09.A1(IN1) ; also sheet 7
!MK_DATA: A09.B1(IN2) ; also sheet 7
!MK_END: A09.D1(IN4) ; also sheet 7
!MKTK: A08.P2 A09.K2(IN1) ; also sheet 11
!PAR: A08.S1 A12.E1(IN2) ; also sheet 11
!PC+ES: A11.J2(7:OUT) ; also sheet 2
!PWR_CLR: A10.H2(IN1) A12.A1(IN1) ; also sheet 1,2,4,5
!SE: A09.H1(IN2) ; also sheet 2
!SEL: A08.J2 A09.N2(IN4) ; also sheet 11
!ST_BLK_MK: A09.D2(IN1) A09.M1(IN1) ; also sheet 5
!ST_IDLE: A09.E2(IN2) A09.N1(IN2) ; also sheet 5
!T_SINGLE_UNIT: B21.T2(IN) ; also sheet 12
!TIM: A08.M1 A09.L2(IN2) ; also sheet 11
!XSTA: D16.M2(H2) D16.N2(J2) ; also sheet 1,3
+3V@A09U1: A08.D1(A1:S) A08.F2(A1B:S) A08.K2(K2:R) ; also sheet 2,4
-MOVE: A09.F2(IN3)
-SWTM: C10.L2(IN1B)
-WRITE_OK: A10.J1(IN2) C17.J2(7:OUT)
-WRTM: C10.M2(IN2A)
B-XSTA: A10.E2(IN2) ; also sheet 1,4
CSTA: D16.P2(K2) ; also sheet 1
DF: A10.P2(IN1) ; also sheet 4,12
DTF: A08.J1(A1C:D) ; also sheet 1,4,12
EF: A11.J1(6:IN) A12.F1(OUT) ; also sheet 1,12
END: A08.E1 ; also sheet 12
FR_01: A10.H1(IN1) ; also sheet 1,2,5,12
LPB_NOT_EQ_1: A10.M1(IN2) ; also sheet 9
MC01: A08.L2(K2:C) ; also sheet 4,12
MK_END: A08.C1(A1:D) ; also sheet 7
MKTK: A08.R2 ; also sheet 12
N$34: C17.S2(15:IN) D16.T2(F2)
N$35: A09.F1(IN1) C10.P2(OUT)
N$46: A09.J1(IN3) A10.K1(OUT)
N$80: A09.K1(IN4) B21.U2(OUT)
N$83: A08.E2(A1B:D) A09.L1(OUT)
N$105: A09.E1(OUT) A11.A1(1:IN)
N$106: A09.H2(IN4) A11.B1(1:OUT)
N$107: A08.M2(K2:D) A09.J2(OUT)
N$124: A10.S1(OUT) A11.C1(2:IN)
N$125: A08.P1(K2B:D) A10.N1(OUT)
N$128: A08.N1(K2B:C) A11.D2(2:OUT)
N$132: A08.K1(A1C:S) A11.E1(3:OUT)
N$137: A10.V2(OUT) A11.D1(3:IN)
N$138: A09.S1(OUT) A10.U2(IN2)
N$139: A10.S2(OUT) A10.T2(IN1)
N$150: D16.S1(H1) D16.S2(L2)
N$151: D16.R2(E2) D16.V2(D2)
N$153: A10.F2(OUT) A10.J2(IN2)
N$161: A09.P2(OUT) A11.F1(4:IN)
N$162: A11.H1(4:OUT) A12.B1(IN2) A12.D1(IN1)
PAR: A08.U1 ; also sheet 12
PC+ES: A11.H2(7:IN) A12.C1(OUT)
RD+WD: A09.P1(IN3) ; also sheet 2,4
READ_DATA: A10.L1(IN1) ; also sheet 2,4
SEL: A08.H2 ; also sheet 12
SH_DTB: A10.R2(IN2) ; also sheet 5,8
ST_CK: A10.P1(IN1) ; also sheet 4,5,7,12
SWTM: C10.N2(IN2B) ; also sheet 3,5,12
TIM: A08.L1 ; also sheet 12
TP00: A08.B1(A1:C) ; also sheet 3,4,5
WRITE_OK: C17.H2(7:IN) ; also sheet 2,5
WRTM: C10.K2(IN1A) ; also sheet 2,3,5
XSA_DY: A08.D2(A1B:C) C17.T2(15:OUT) ; also sheet 2
XSAD: A09.R1(IN4) ; also sheet 1
Unconnected: C10.U1 C10.V1 D16.D1 D16.D2 D16.E1 D16.E2 D16.F1 D16.F2 D16.H1 D16.H2 D16.J1 D16.J2 D16.K2 D16.L2 D16.N1(D1) D16.P1(E1) D16.R1(F1) D16.U1(J1)

### Notes on the sheet
- M121
- 0_TO_EF\\
- G879
- +3V@A09U1
- 0_TO_EF\\
- 5usec

## Sheet 7 of 12
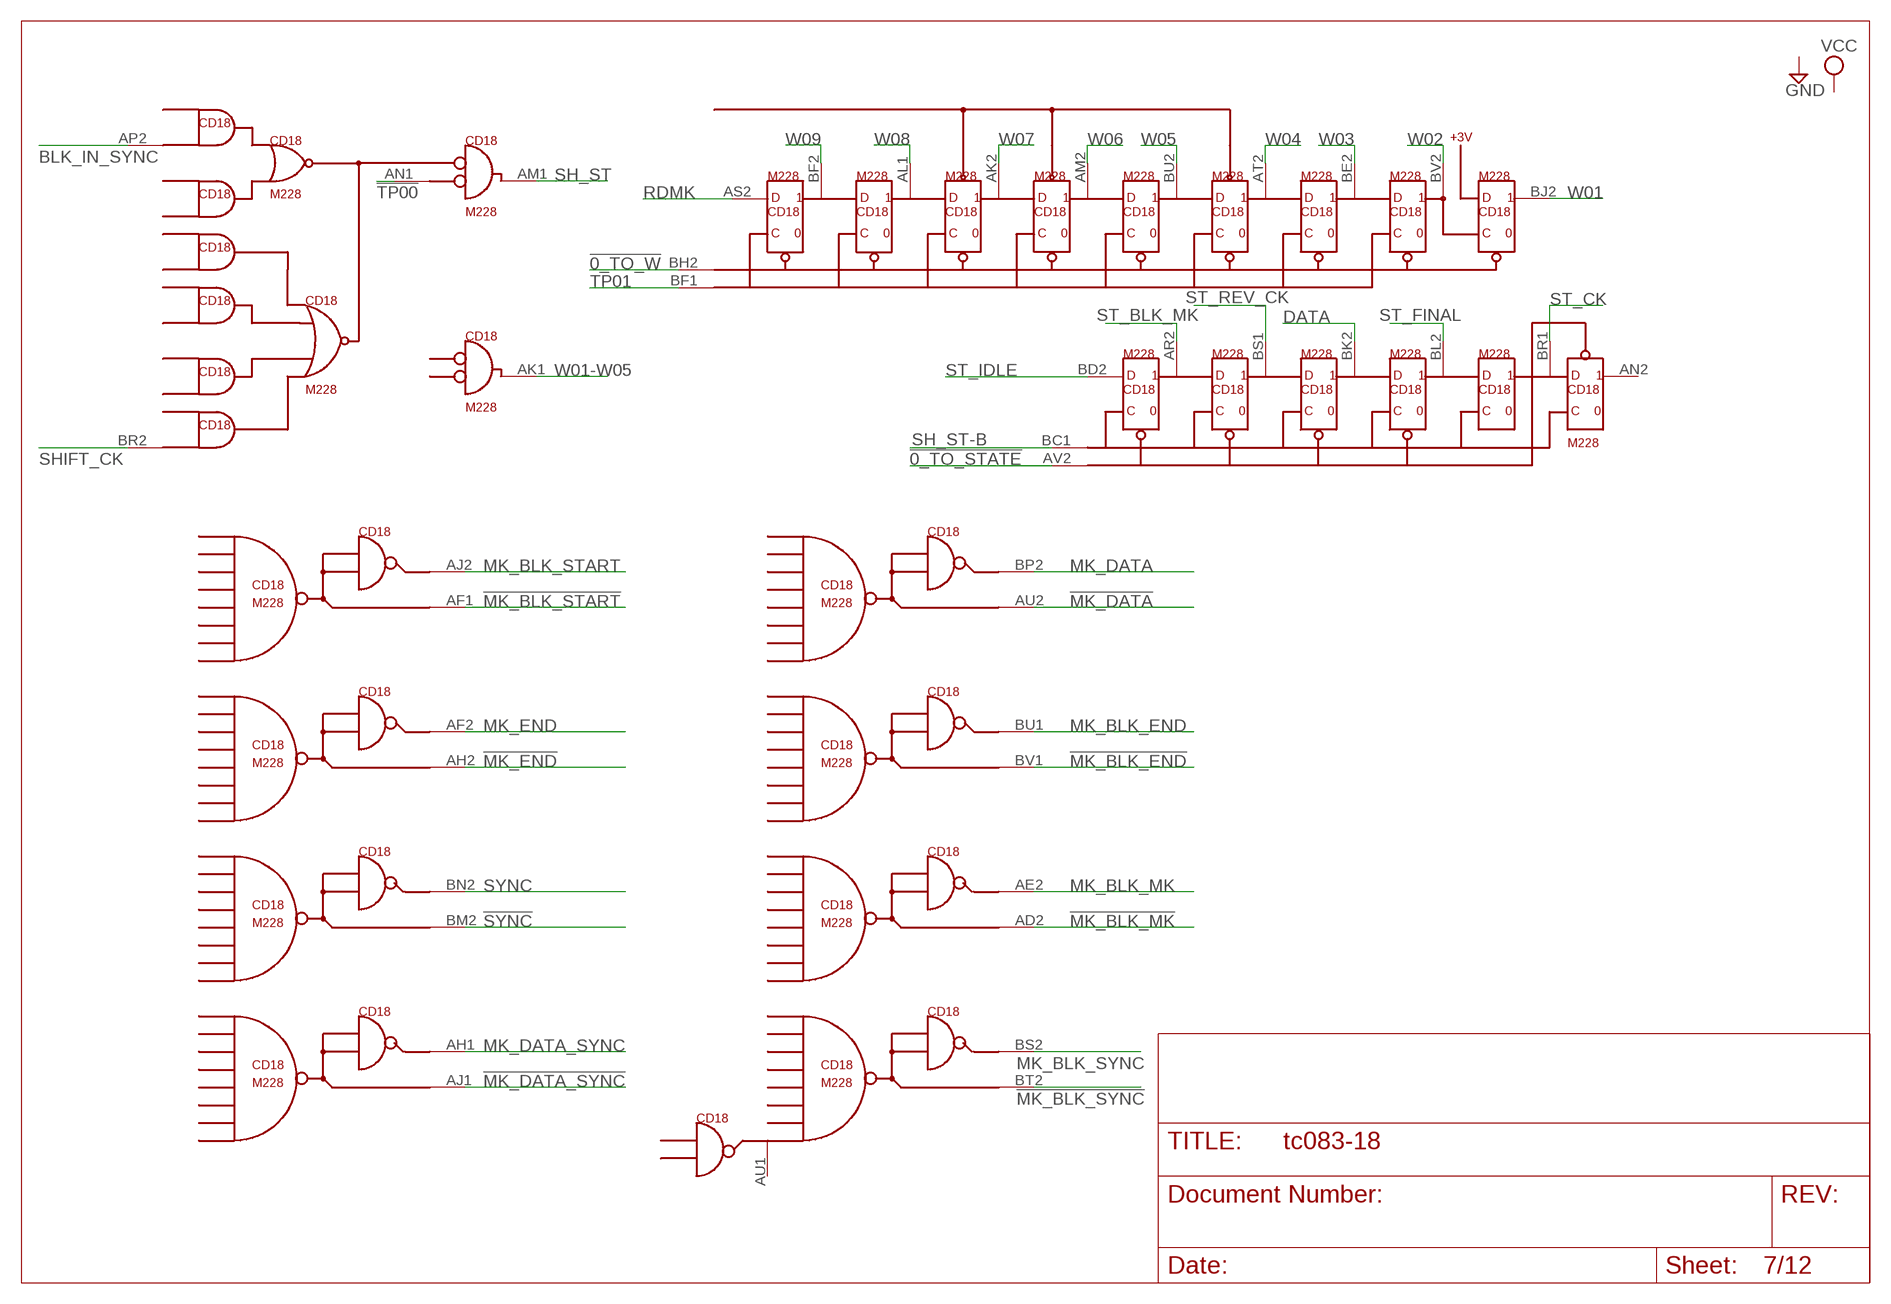
[diagram p6: schematic, sheet 7]

### Parts
CD18  M228  [H807-2]

### Nets
!0_TO_STATE: CD18.AV2 ; also sheet 3
!0_TO_W: CD18.BH2 ; also sheet 3
!MK_BLK_END: CD18.BV1 ; also sheet 6
!MK_BLK_MK: CD18.AD2
!MK_BLK_START: CD18.AF1 ; also sheet 6
!MK_BLK_SYNC: CD18.BT2
!MK_DATA: CD18.AU2 ; also sheet 6
!MK_DATA_SYNC: CD18.AJ1
!MK_END: CD18.AH2 ; also sheet 6
!SYNC: CD18.BM2
!TP00: CD18.AN1 ; also sheet 3
BLK_IN_SYNC: CD18.AP2 ; also sheet 4
DATA: CD18.BK2 ; also sheet 5,12
MK_BLK_END: CD18.BU1 ; also sheet 9
MK_BLK_MK: CD18.AE2 ; also sheet 4
MK_BLK_START: CD18.AJ2
MK_BLK_SYNC: CD18.BS2
MK_DATA: CD18.BP2
MK_DATA_SYNC: CD18.AH1
MK_END: CD18.AF2 ; also sheet 6
RDMK: CD18.AS2 ; also sheet 10
SH_ST: CD18.AM1 ; also sheet 1
SH_ST-B: CD18.BC1 ; also sheet 1
SHIFT_CK: CD18.BR2 ; also sheet 5
ST_BLK_MK: CD18.AR2 ; also sheet 5,12
ST_CK: CD18.BR1 ; also sheet 4,5,6,12
ST_FINAL: CD18.BL2 ; also sheet 4,5,9,12
ST_IDLE: CD18.BD2 ; also sheet 5,12
ST_REV_CK: CD18.BS1 ; also sheet 4,5,9,12
SYNC: CD18.BN2 ; also sheet 4
TP01: CD18.BF1 ; also sheet 3,5,9
W01: CD18.BJ2 ; also sheet 12
W01-W05: CD18.AK1
W02: CD18.BV2 ; also sheet 12
W03: CD18.BE2 ; also sheet 12
W04: CD18.AT2 ; also sheet 12
W05: CD18.BU2 ; also sheet 12
W06: CD18.AM2 ; also sheet 12
W07: CD18.AK2 ; also sheet 12
W08: CD18.AL1 ; also sheet 12
W09: CD18.BF2 ; also sheet 12
Unconnected: CD18.AN2 CD18.AU1

## Sheet 8 of 12
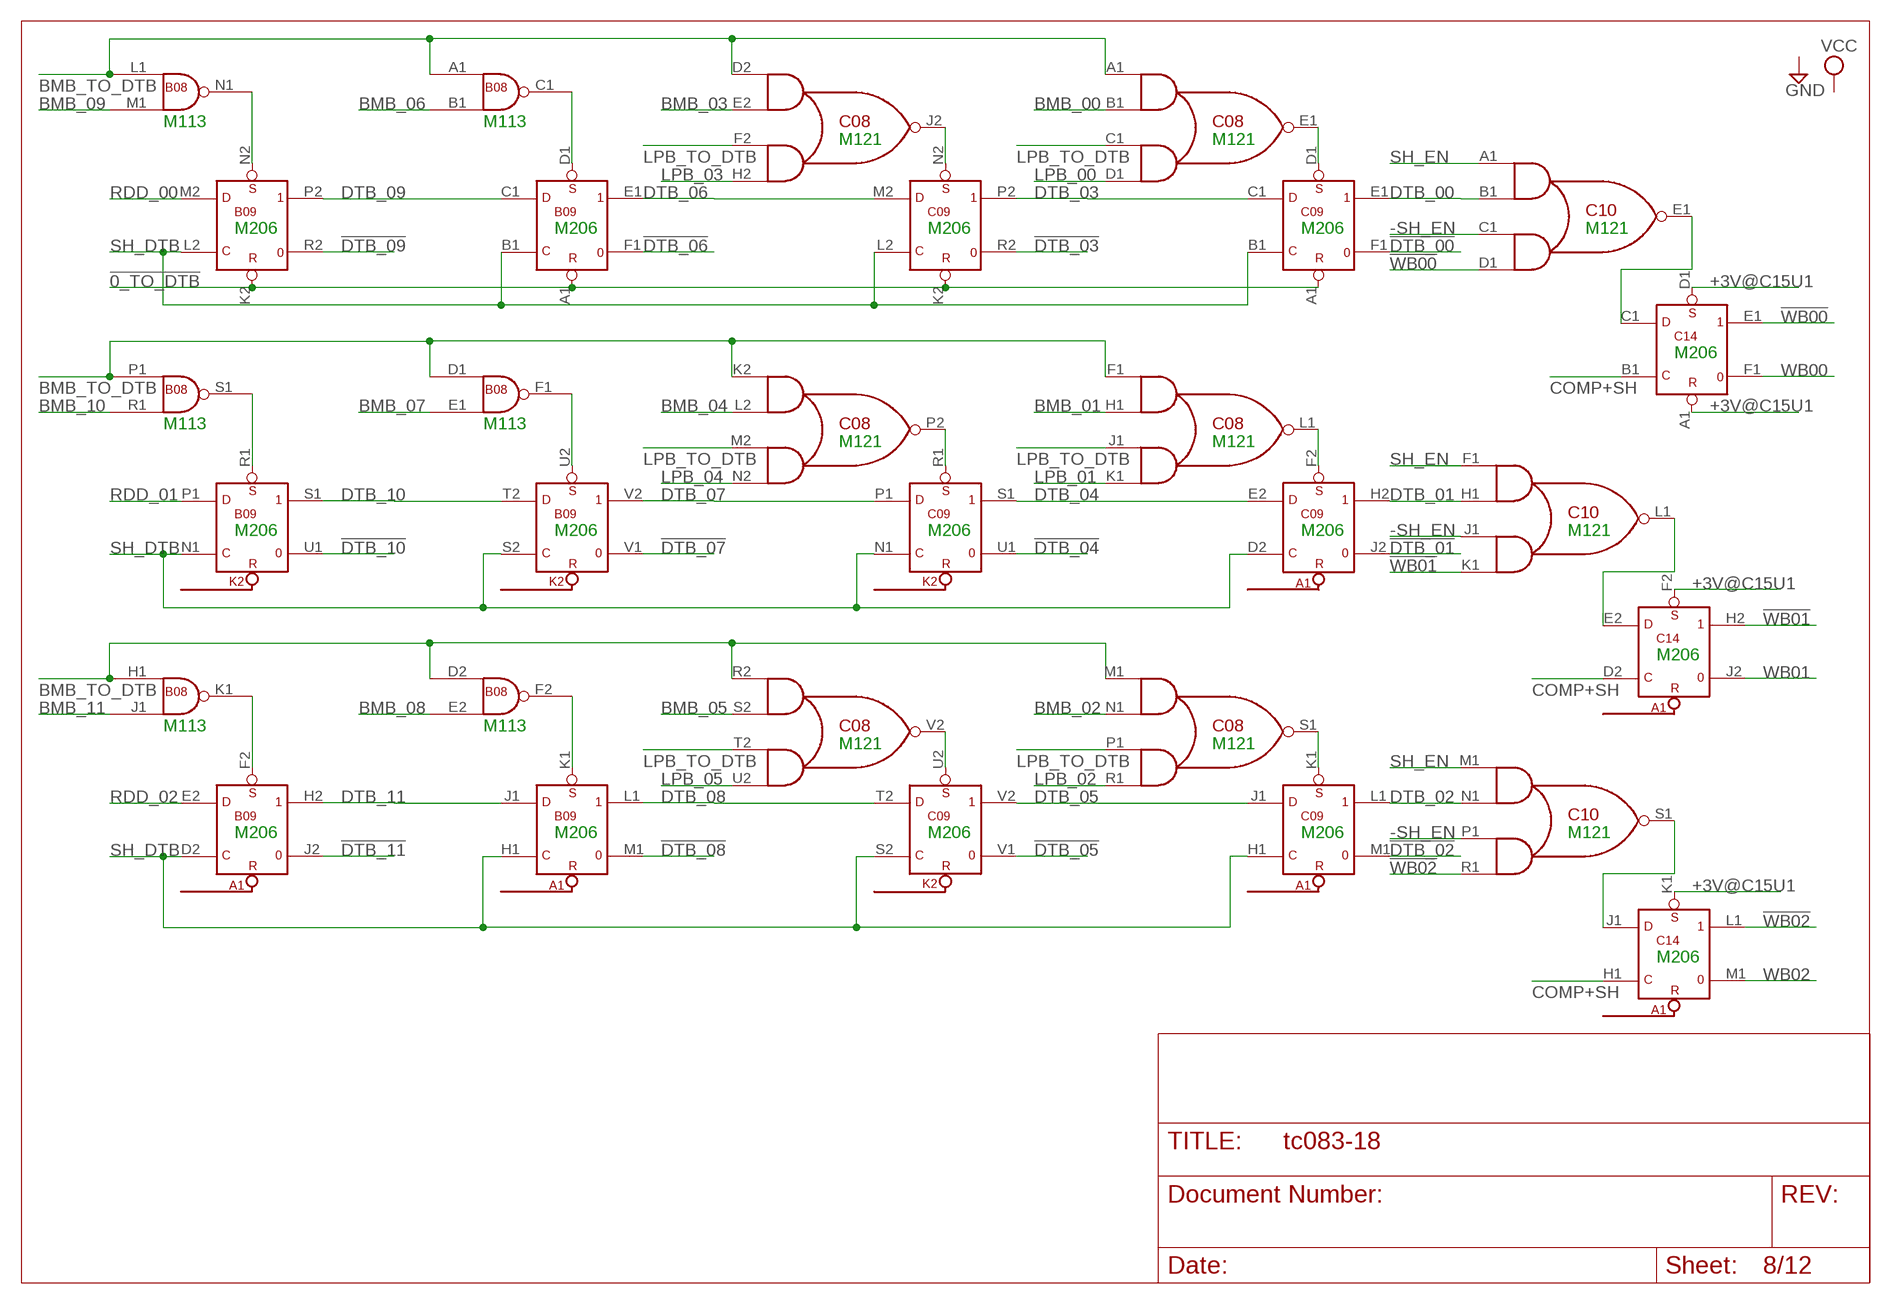
[diagram p7: schematic, sheet 8]

### Parts
B09  M206X  [H807]
C09  M206X  [H807]

### Nets
!0_TO_DTB: B09.A1(A1:R) B09.K2(K2:R) C09.A1(A1:R) C09.K2(K2:R) ; also sheet 5
!DTB_00: C09.F1 ; also sheet 11
!DTB_01: C09.J2 ; also sheet 11
!DTB_02: C09.M1 ; also sheet 11
!DTB_03: C09.R2 ; also sheet 11
!DTB_04: C09.U1 ; also sheet 11
!DTB_05: C09.V1 ; also sheet 11
!DTB_06: B09.F1 ; also sheet 11
!DTB_07: B09.V1 ; also sheet 11
!DTB_08: B09.M1 ; also sheet 11
!DTB_09: B09.R2 ; also sheet 11
!DTB_10: B09.U1 ; also sheet 11
!DTB_11: B09.J2 ; also sheet 11
!WB00: C10.D1(IN2B) C14.E1 ; also sheet 10
!WB01: C10.K1(IN2B) C14.H2 ; also sheet 10
!WB02: C10.R1(IN2B) C14.L1 ; also sheet 10
+3V@C15U1: C14.A1(A1:R) C14.D1(A1:S) C14.F2(A1B:S) C14.K1(A1C:S) ; also sheet 3,5
-SH_EN: C10.C1(IN2A) C10.J1(IN2A) C10.P1(IN2A) ; also sheet 5
BMB_00: C08.B1(IN1B) ; also sheet 10
BMB_01: C08.H1(IN1B) ; also sheet 10
BMB_02: C08.N1(IN1B) ; also sheet 10
BMB_03: C08.E2(IN1B) ; also sheet 10
BMB_04: C08.L2(IN1B) ; also sheet 10
BMB_05: C08.S2(IN1B) ; also sheet 10
BMB_06: B08.B1(IN2) ; also sheet 10
BMB_07: B08.E1(IN2) ; also sheet 10
BMB_08: B08.E2(IN2) ; also sheet 10
BMB_09: B08.M1(IN2) ; also sheet 10
BMB_10: B08.R1(IN2) ; also sheet 10
BMB_11: B08.J1(IN2) ; also sheet 10
BMB_TO_DTB: B08.A1(IN1) B08.D1(IN1) B08.D2(IN1) B08.H1(IN1) B08.L1(IN1) B08.P1(IN1) C08.A1(IN1A) C08.D2(IN1A) C08.F1(IN1A) C08.K2(IN1A) C08.M1(IN1A) C08.R2(IN1A) ; also sheet 1
COMP+SH: C14.B1(A1:C) C14.D2(A1B:C) C14.H1(A1C:C) ; also sheet 5
DTB_00: C09.E1 C10.B1(IN1B) ; also sheet 9,12
DTB_01: C09.H2 C10.H1(IN1B) ; also sheet 9,12
DTB_02: C09.L1 C10.N1(IN1B) ; also sheet 9,12
DTB_03: C09.C1(A1:D) C09.P2 ; also sheet 12
DTB_04: C09.E2(A1B:D) C09.S1 ; also sheet 12
DTB_05: C09.J1(A1C:D) C09.V2 ; also sheet 12
DTB_06: B09.E1 C09.M2(K2:D) ; also sheet 12
DTB_07: B09.V2 C09.P1(K2B:D) ; also sheet 12
DTB_08: B09.L1 C09.T2(K2C:D) ; also sheet 12
DTB_09: B09.C1(A1:D) B09.P2 ; also sheet 12
DTB_10: B09.S1 B09.T2(K2C:D) ; also sheet 12
DTB_11: B09.H2 B09.J1(A1C:D) ; also sheet 12
LPB_00: C08.D1(IN2B) ; also sheet 9,12
LPB_01: C08.K1(IN2B) ; also sheet 9,12
LPB_02: C08.R1(IN2B) ; also sheet 9,12
LPB_03: C08.H2(IN2B) ; also sheet 9,12
LPB_04: C08.N2(IN2B) ; also sheet 9,12
LPB_05: C08.U2(IN2B) ; also sheet 9,12
LPB_TO_DTB: C08.C1(IN2A) C08.F2(IN2A) C08.J1(IN2A) C08.M2(IN2A) C08.P1(IN2A) C08.T2(IN2A) ; also sheet 9
N$73: B08.N1(OUT) B09.N2(K2:S)
N$91: B08.S1(OUT) B09.R1(K2B:S)
N$92: B08.K1(OUT) B09.F2(A1B:S)
N$97: B08.C1(OUT) B09.D1(A1:S)
N$104: C08.J2(OUT) C09.N2(K2:S)
N$112: B08.F1(OUT) B09.U2(K2C:S)
N$113: B08.F2(OUT) B09.K1(A1C:S)
N$129: C08.V2(OUT) C09.U2(K2C:S)
N$142: C08.P2(OUT) C09.R1(K2B:S)
N$146: C08.E1(OUT) C09.D1(A1:S)
N$147: C08.L1(OUT) C09.F2(A1B:S)
N$148: C08.S1(OUT) C09.K1(A1C:S)
N$155: C10.L1(OUT) C14.E2(A1B:D)
N$185: C10.E1(OUT) C14.C1(A1:D)
N$193: C10.S1(OUT) C14.J1(A1C:D)
RDD_00: B09.M2(K2:D) ; also sheet 9,10
RDD_01: B09.P1(K2B:D) ; also sheet 9,10
RDD_02: B09.E2(A1B:D) ; also sheet 9,10
SH_DTB: B09.B1(A1:C) B09.D2(A1B:C) B09.H1(A1C:C) B09.L2(K2:C) B09.N1(K2B:C) B09.S2(K2C:C) C09.B1(A1:C) C09.D2(A1B:C) C09.H1(A1C:C) C09.L2(K2:C) C09.N1(K2B:C) C09.S2(K2C:C) ; also sheet 5,6
SH_EN: C10.A1(IN1A) C10.F1(IN1A) C10.M1(IN1A) ; also sheet 5
WB00: C14.F1 ; also sheet 9,10,12
WB01: C14.J2 ; also sheet 9,10,12
WB02: C14.M1 ; also sheet 9,10,12

### Notes on the sheet
- M113 | M113
- M121 | M121
- M206 | M206 | M206 | M206 | M121
- M206
- M113 | M113
- M121 | M121
- M206 | M206 | M206 | M206 | M121
- M206
- M113 | M113
- M121 | M121
- M206 | M206 | M206 | M206 | M121
- M206

## Sheet 9 of 12
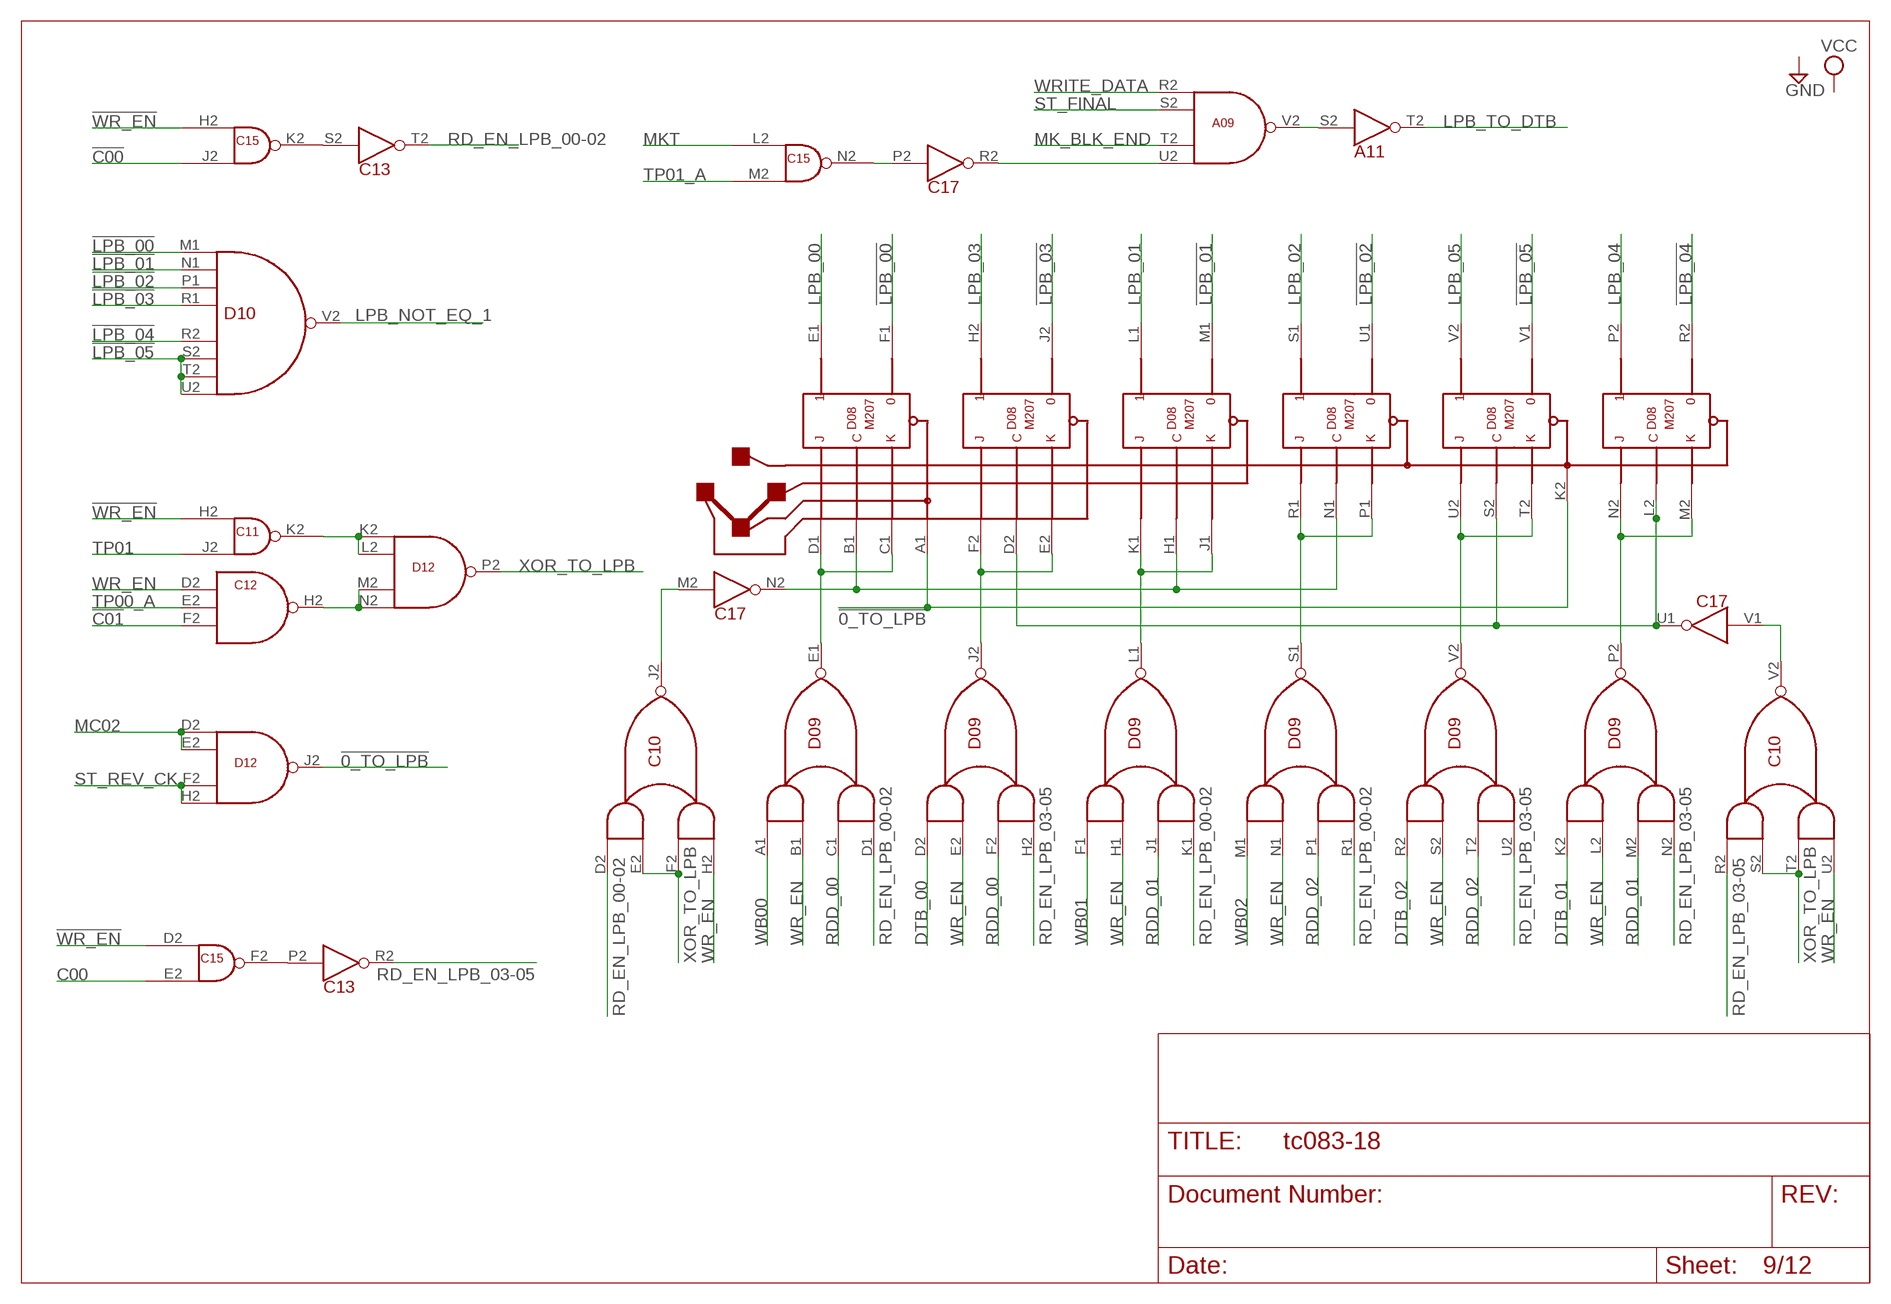
[diagram p8: schematic, sheet 9]

### Parts
D08  M207  [H807]

### Nets
!0_TO_LPB: D08.A1 D08.K2 D12.J2(OUT)
!C00: C15.J2(IN2) ; also sheet 4,5
!C01: C12.F2(IN3) ; also sheet 4,5
!LPB_00: D08.F1 D10.M1(IN1)
!LPB_01: D08.M1 D10.N1(IN2)
!LPB_02: D08.U1 D10.P1(IN3)
!LPB_03: D08.J2 D10.R1(IN4)
!LPB_04: D08.R2 D10.R2(IN5)
!LPB_05: D08.V1 D10.S2(IN6) D10.T2(IN7) D10.U2(IN8)
!WR_EN: C11.H2(IN1) C15.D2(IN1) C15.H2(IN1) ; also sheet 3,5
C00: C15.E2(IN2) ; also sheet 4,5,12
DTB_00: D09.D2(IN1A) ; also sheet 8,12
DTB_01: D09.K2(IN1A) ; also sheet 8,12
DTB_02: D09.R2(IN1A) ; also sheet 8,12
LPB_00: D08.E1 ; also sheet 8,12
LPB_01: D08.L1 ; also sheet 8,12
LPB_02: D08.S1 ; also sheet 8,12
LPB_03: D08.H2 ; also sheet 8,12
LPB_04: D08.P2 ; also sheet 8,12
LPB_05: D08.V2 ; also sheet 8,12
LPB_NOT_EQ_1: D10.V2(OUT) ; also sheet 6
LPB_TO_DTB: A11.T2(15:OUT) ; also sheet 8
MC02: D12.D2(IN1) D12.E2(IN2) ; also sheet 4,5,12
MK_BLK_END: A09.T2(IN3) ; also sheet 7
MKT: C15.L2(IN1) ; also sheet 4,5,12
N$93: D08.C1 D08.D1 D09.E1(OUT)
N$94: D08.E2 D08.F2 D09.J2(OUT)
N$95: D08.J1 D08.K1 D09.L1(OUT)
N$96: D08.P1 D08.R1 D09.S1(OUT)
N$99: D08.T2 D08.U2 D09.V2(OUT)
N$100: D08.M2 D08.N2 D09.P2(OUT)
N$101: C17.U1(14:OUT) D08.D2 D08.L2 D08.S2
N$103: C17.N2(11:OUT) D08.B1 D08.H1 D08.N1
N$108: C10.J2(OUT) C17.M2(11:IN)
N$109: C10.V2(OUT) C17.V1(14:IN)
N$111: A09.U2(IN4) C17.R2(13:OUT)
N$114: A09.V2(OUT) A11.S2(15:IN)
N$115: C15.N2(OUT) C17.P2(13:IN)
N$116: C13.S2(15:IN) C15.K2(OUT)
N$117: C12.H2(OUT) D12.M2(IN3) D12.N2(IN4)
N$118: C11.K2(OUT) D12.K2(IN1) D12.L2(IN2)
N$119: C13.P2(13:IN) C15.F2(OUT)
RD_EN_LPB_00-02: C10.D2(IN1A) C13.T2(15:OUT) D09.D1(IN2B) D09.K1(IN2B) D09.R1(IN2B)
RD_EN_LPB_03-05: C10.R2(IN1A) C13.R2(13:OUT) D09.H2(IN2B) D09.N2(IN2B) D09.U2(IN2B)
RDD_00: D09.C1(IN2A) D09.F2(IN2A) ; also sheet 8,10
RDD_01: D09.J1(IN2A) D09.M2(IN2A) ; also sheet 8,10
RDD_02: D09.P1(IN2A) D09.T2(IN2A) ; also sheet 8,10
ST_FINAL: A09.S2(IN2) ; also sheet 4,5,7,12
ST_REV_CK: D12.F2(IN3) D12.H2(IN4) ; also sheet 4,5,7,12
TP00_A: C12.E2(IN2) ; also sheet 3,5
TP01: C11.J2(IN2) ; also sheet 3,5,7
TP01_A: C15.M2(IN2) ; also sheet 3,4
WB00: D09.A1(IN1A) ; also sheet 8,10,12
WB01: D09.F1(IN1A) ; also sheet 8,10,12
WB02: D09.M1(IN1A) ; also sheet 8,10,12
WR_EN: C10.H2(IN2B) C10.U2(IN2B) C12.D2(IN1) D09.B1(IN1B) D09.E2(IN1B) D09.H1(IN1B) D09.L2(IN1B) D09.N1(IN1B) D09.S2(IN1B) ; also sheet 3,5,10,12
WRITE_DATA: A09.R2(IN1) ; also sheet 2,5
XOR_TO_LPB: C10.E2(IN1B) C10.F2(IN2A) C10.S2(IN1B) C10.T2(IN2A) D12.P2(OUT)

## Sheet 10 of 12
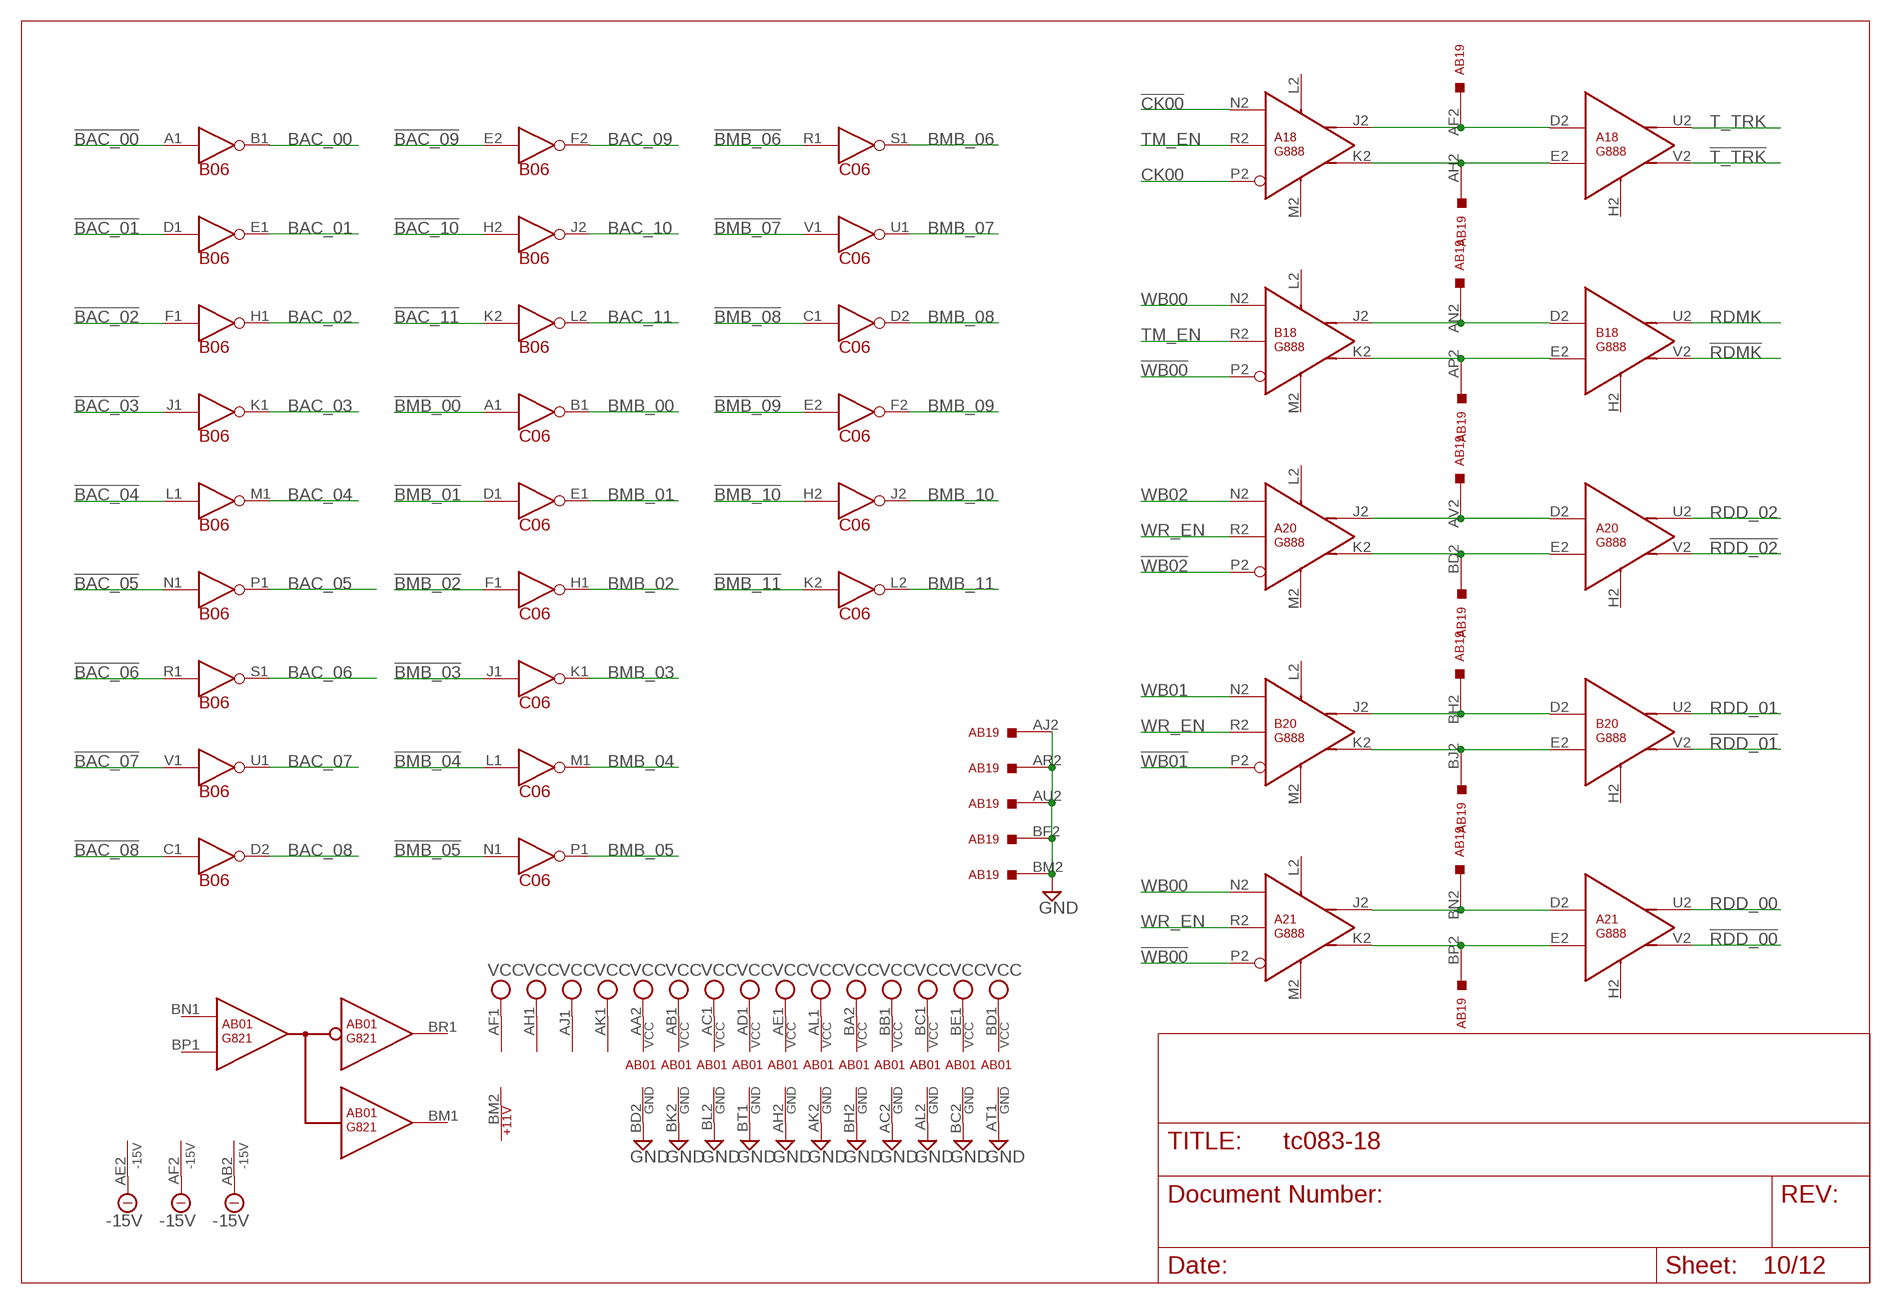
[diagram p9: schematic, sheet 10]

### Parts
A18  G888  [H807]
A20  G888  [H807]
A21  G888  [H807]
AB01  G821  [H807-2]
AB19  W032  [H807-2]
B18  G888  [H807]
B20  G888  [H807]

### Nets
!BAC_00: B06.A1(1:IN) ; also sheet 3,11
!BAC_01: B06.D1(3:IN) ; also sheet 3,11
!BAC_02: B06.F1(4:IN) ; also sheet 3,11
!BAC_03: B06.J1(6:IN) ; also sheet 3,11
!BAC_04: B06.L1(8:IN) ; also sheet 3,11
!BAC_05: B06.N1(10:IN) ; also sheet 11
!BAC_06: B06.R1(12:IN) ; also sheet 11
!BAC_07: B06.V1(14:IN) ; also sheet 11
!BAC_08: B06.C1(2:IN) ; also sheet 11
!BAC_09: B06.E2(5:IN) ; also sheet 11
!BAC_10: B06.H2(7:IN) ; also sheet 6,11
!BAC_11: B06.K2(9:IN) ; also sheet 4,11
!BMB_00: C06.A1(1:IN) ; also sheet 11
!BMB_01: C06.D1(3:IN) ; also sheet 11
!BMB_02: C06.F1(4:IN) ; also sheet 11
!BMB_03: C06.J1(6:IN) ; also sheet 11
!BMB_04: C06.L1(8:IN) ; also sheet 11
!BMB_05: C06.N1(10:IN) ; also sheet 11
!BMB_06: C06.R1(12:IN) ; also sheet 11
!BMB_07: C06.V1(14:IN) ; also sheet 11
!BMB_08: C06.C1(2:IN) ; also sheet 11
!BMB_09: C06.E2(5:IN) ; also sheet 11
!BMB_10: C06.H2(7:IN) ; also sheet 11
!BMB_11: C06.K2(9:IN) ; also sheet 11
!CK00: A18.N2 ; also sheet 3
!RDD_00: A21.V2
!RDD_01: B20.V2
!RDD_02: A20.V2
!RDMK: B18.V2
!T_TRK: A18.V2 ; also sheet 3
!WB00: A21.P2 B18.P2 ; also sheet 8
!WB01: B20.P2 ; also sheet 8
!WB02: A20.P2 ; also sheet 8
+11V: AB01.BM2(+11V)
-15V: AB01.AB2(-15V) AB01.AE2(-15V) AB01.AF2(-15V)
BAC_00: B06.B1(1:OUT) ; also sheet 2
BAC_01: B06.E1(3:OUT) ; also sheet 2
BAC_02: B06.H1(4:OUT) ; also sheet 2
BAC_03: B06.K1(6:OUT) ; also sheet 2
BAC_04: B06.M1(8:OUT) ; also sheet 2
BAC_05: B06.P1(10:OUT) ; also sheet 2
BAC_06: B06.S1(12:OUT) ; also sheet 1,2
BAC_07: B06.U1(14:OUT) ; also sheet 1,2
BAC_08: B06.D2(2:OUT) ; also sheet 1,2
BAC_09: B06.F2(5:OUT) ; also sheet 2
BAC_10: B06.J2(7:OUT)
BAC_11: B06.L2(9:OUT)
BMB_00: C06.B1(1:OUT) ; also sheet 8
BMB_01: C06.E1(3:OUT) ; also sheet 8
BMB_02: C06.H1(4:OUT) ; also sheet 8
BMB_03: C06.K1(6:OUT) ; also sheet 8
BMB_04: C06.M1(8:OUT) ; also sheet 8
BMB_05: C06.P1(10:OUT) ; also sheet 8
BMB_06: C06.S1(12:OUT) ; also sheet 8
BMB_07: C06.U1(14:OUT) ; also sheet 8
BMB_08: C06.D2(2:OUT) ; also sheet 8
BMB_09: C06.F2(5:OUT) ; also sheet 8
BMB_10: C06.J2(7:OUT) ; also sheet 8
BMB_11: C06.L2(9:OUT) ; also sheet 8
CK00: A18.P2 ; also sheet 3
GND: AB01.AC2(GND) AB01.AH2(GND) AB01.AK2(GND) AB01.AL2(GND) AB01.AT1(GND) AB01.BC2(GND) AB01.BD2(GND) AB01.BH2(GND) AB01.BK2(GND) AB01.BL2(GND) AB01.BT1(GND) AB19.AJ2 AB19.AR2 AB19.AU2 AB19.BF2 AB19.BM2 ; also sheet 1,2,4,11,12
N$123: A18.D2 A18.J2 AB19.AF2
N$126: A18.E2 A18.K2 AB19.AH2
N$127: AB19.AN2 B18.D2 B18.J2
N$130: AB19.AP2 B18.E2 B18.K2
N$131: A20.D2 A20.J2 AB19.AV2
N$133: A20.E2 A20.K2 AB19.BD2
N$134: AB19.BH2 B20.D2 B20.J2
N$135: AB19.BJ2 B20.E2 B20.K2
N$136: A21.D2 A21.J2 AB19.BN2
N$140: A21.E2 A21.K2 AB19.BP2
RDD_00: A21.U2 ; also sheet 8,9
RDD_01: B20.U2 ; also sheet 8,9
RDD_02: A20.U2 ; also sheet 8,9
RDMK: B18.U2 ; also sheet 7
T_TRK: A18.U2 ; also sheet 3
TM_EN: A18.R2 B18.R2 ; also sheet 3
VCC: AB01.AA2(VCC) AB01.AB1(VCC) AB01.AC1(VCC) AB01.AD1(VCC) AB01.AE1(VCC) AB01.AF1(VCC) AB01.AH1(VCC) AB01.AJ1(VCC) AB01.AK1(VCC) AB01.AL1(VCC) AB01.BA2(VCC) AB01.BB1(VCC) AB01.BC1(VCC) AB01.BD1(VCC) AB01.BE1(VCC)
WB00: A21.N2 B18.N2 ; also sheet 8,9,12
WB01: B20.N2 ; also sheet 8,9,12
WB02: A20.N2 ; also sheet 8,9,12
WR_EN: A20.R2 A21.R2 B20.R2 ; also sheet 3,5,9,12
Unconnected: A18.H2 A18.L2 A18.M2 A20.H2 A20.L2 A20.M2 A21.H2 A21.L2 A21.M2 AB01.BM1 AB01.BN1 AB01.BP1 AB01.BR1 B18.H2 B18.L2 B18.M2 B20.H2 B20.L2 B20.M2

## Sheet 11 of 12
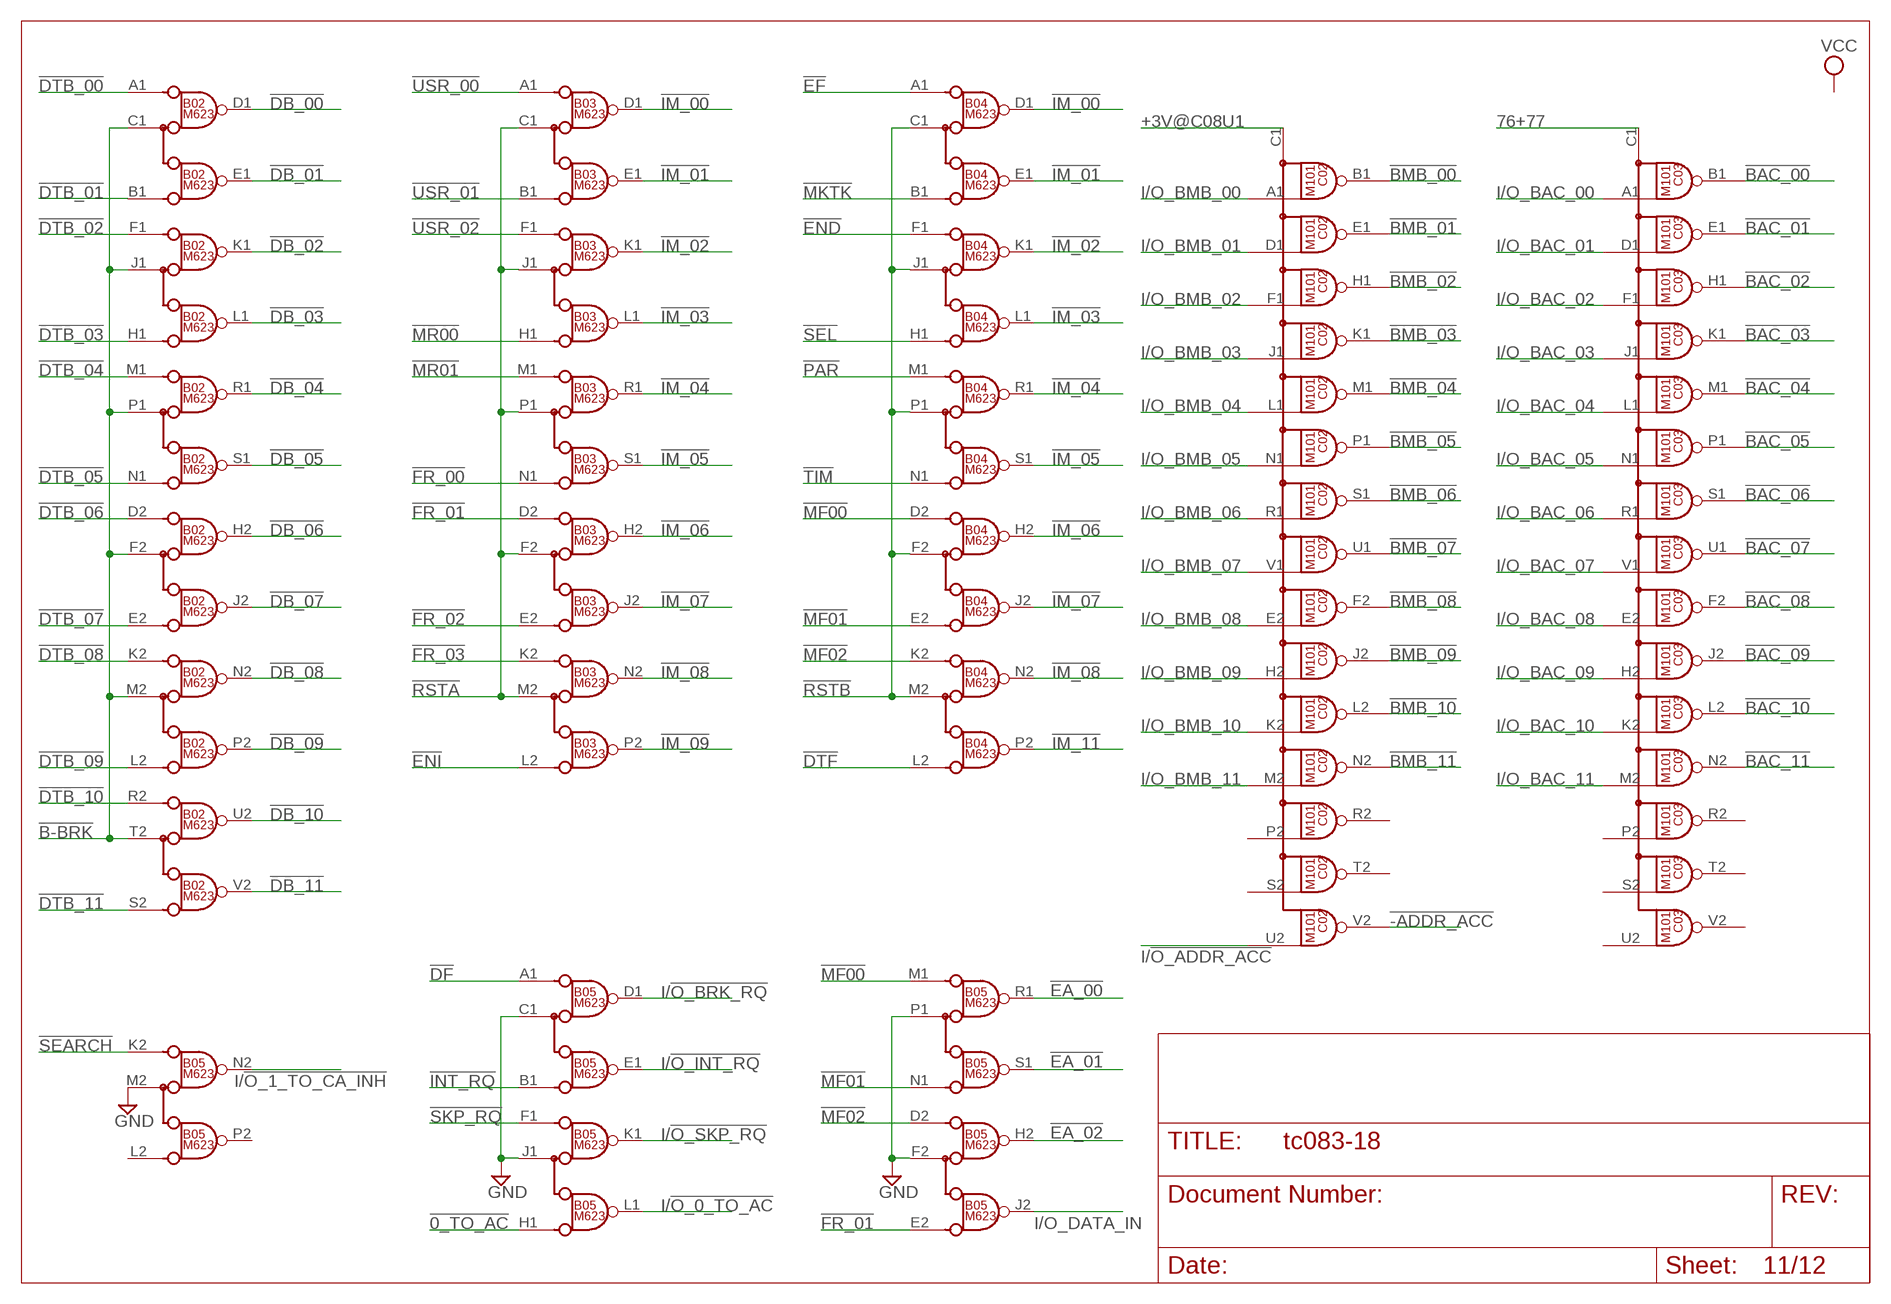
[diagram p10: schematic, sheet 11]

### Parts
B02  M623  [H807]
B03  M623  [H807]
B04  M623  [H807]
B05  M623  [H807]
C02  M101-ARRAY  [H807]
C03  M101-ARRAY  [H807]

### Nets
76+77: C03.C1(ENABLE) ; also sheet 1
!0_TO_AC: B05.H1(B) ; also sheet 1
!-ADDR_ACC: C02.V2(O15) ; also sheet 1
!B-BRK: B02.C1(C) B02.F2(C) B02.J1(C) B02.M2(C) B02.P1(C) B02.T2(C) ; also sheet 1
!BAC_00: C03.B1(O1) ; also sheet 3,10
!BAC_01: C03.E1(O2) ; also sheet 3,10
!BAC_02: C03.H1(O3) ; also sheet 3,10
!BAC_03: C03.K1(O4) ; also sheet 3,10
!BAC_04: C03.M1(O5) ; also sheet 3,10
!BAC_05: C03.P1(O6) ; also sheet 10
!BAC_06: C03.S1(O7) ; also sheet 10
!BAC_07: C03.U1(O8) ; also sheet 10
!BAC_08: C03.F2(O9) ; also sheet 10
!BAC_09: C03.J2(O10) ; also sheet 10
!BAC_10: C03.L2(O11) ; also sheet 6,10
!BAC_11: C03.N2(O12) ; also sheet 4,10
!BMB_00: C02.B1(O1) ; also sheet 10
!BMB_01: C02.E1(O2) ; also sheet 10
!BMB_02: C02.H1(O3) ; also sheet 10
!BMB_03: C02.K1(O4) ; also sheet 10
!BMB_04: C02.M1(O5) ; also sheet 10
!BMB_05: C02.P1(O6) ; also sheet 10
!BMB_06: C02.S1(O7) ; also sheet 10
!BMB_07: C02.U1(O8) ; also sheet 10
!BMB_08: C02.F2(O9) ; also sheet 10
!BMB_09: C02.J2(O10) ; also sheet 10
!BMB_10: C02.L2(O11) ; also sheet 10
!BMB_11: C02.N2(O12) ; also sheet 10
!DB_00: B02.D1(D) ; also sheet 12
!DB_01: B02.E1(E) ; also sheet 12
!DB_02: B02.K1(D) ; also sheet 12
!DB_03: B02.L1(E) ; also sheet 12
!DB_04: B02.R1(D) ; also sheet 12
!DB_05: B02.S1(E) ; also sheet 12
!DB_06: B02.H2(D) ; also sheet 12
!DB_07: B02.J2(E) ; also sheet 12
!DB_08: B02.N2(D) ; also sheet 12
!DB_09: B02.P2(E) ; also sheet 12
!DB_10: B02.U2(D) ; also sheet 12
!DB_11: B02.V2(E) ; also sheet 12
!DF: B05.A1(A) ; also sheet 4,5
!DTB_00: B02.A1(A) ; also sheet 8
!DTB_01: B02.B1(B) ; also sheet 8
!DTB_02: B02.F1(A) ; also sheet 8
!DTB_03: B02.H1(B) ; also sheet 8
!DTB_04: B02.M1(A) ; also sheet 8
!DTB_05: B02.N1(B) ; also sheet 8
!DTB_06: B02.D2(A) ; also sheet 8
!DTB_07: B02.E2(B) ; also sheet 8
!DTB_08: B02.K2(A) ; also sheet 8
!DTB_09: B02.L2(B) ; also sheet 8
!DTB_10: B02.R2(A) ; also sheet 8
!DTB_11: B02.S2(B) ; also sheet 8
!DTF: B04.L2(B) ; also sheet 4,5
!EA_00: B05.R1(D) ; also sheet 12
!EA_01: B05.S1(E) ; also sheet 12
!EA_02: B05.H2(D) ; also sheet 12
!EF: B04.A1(A) ; also sheet 6
!END: B04.F1(A) ; also sheet 6
!ENI: B03.L2(B) ; also sheet 2
!FR_00: B03.N1(B) ; also sheet 2,4
!FR_01: B03.D2(A) B05.E2(B) ; also sheet 2,5
!FR_02: B03.E2(B) ; also sheet 2
!FR_03: B03.K2(A) ; also sheet 2
!IM_00: B03.D1(D) B04.D1(D) ; also sheet 12
!IM_01: B03.E1(E) B04.E1(E) ; also sheet 12
!IM_02: B03.K1(D) B04.K1(D) ; also sheet 12
!IM_03: B03.L1(E) B04.L1(E) ; also sheet 12
!IM_04: B03.R1(D) B04.R1(D) ; also sheet 12
!IM_05: B03.S1(E) B04.S1(E) ; also sheet 12
!IM_06: B03.H2(D) B04.H2(D) ; also sheet 12
!IM_07: B03.J2(E) B04.J2(E) ; also sheet 12
!IM_08: B03.N2(D) B04.N2(D) ; also sheet 12
!IM_09: B03.P2(E) ; also sheet 12
!IM_11: B04.P2(E) ; also sheet 12
!INT_RQ: B05.B1(B) ; also sheet 1
!MF00: B04.D2(A) B05.M1(A) ; also sheet 1
!MF01: B04.E2(B) B05.N1(B) ; also sheet 1
!MF02: B04.K2(A) B05.D2(A) ; also sheet 1
!MKTK: B04.B1(B) ; also sheet 6
!MR00: B03.H1(B) ; also sheet 2
!MR01: B03.M1(A) ; also sheet 2
!PAR: B04.M1(A) ; also sheet 6
!RSTA: B03.C1(C) B03.F2(C) B03.J1(C) B03.M2(C) B03.P1(C) ; also sheet 1
!RSTB: B04.C1(C) B04.F2(C) B04.J1(C) B04.M2(C) B04.P1(C) ; also sheet 1
!SEARCH: B05.K2(A) ; also sheet 2,5
!SEL: B04.H1(B) ; also sheet 6
!SKP_RQ: B05.F1(A) ; also sheet 1
!TIM: B04.N1(B) ; also sheet 6
!USR_00: B03.A1(A) ; also sheet 2
!USR_01: B03.B1(B) ; also sheet 2
!USR_02: B03.F1(A) ; also sheet 2
+3V@C08U1: C02.C1(ENABLE) ; also sheet 1
GND: B05.C1(C) B05.F2(C) B05.J1(C) B05.M2(C) B05.P1(C) ; also sheet 1,2,4,10,12
I/!O_0_TO_AC: B05.L1(E) ; also sheet 12
I/!O_1_TO_CA_INH: B05.N2(D) ; also sheet 12
I/!O_ADDR_ACC: C02.U2(IN15) ; also sheet 12
I/!O_BRK_RQ: B05.D1(D) ; also sheet 12
I/!O_INT_RQ: B05.E1(E) ; also sheet 12
I/!O_SKP_RQ: B05.K1(D) ; also sheet 12
I/O_BAC_00: C03.A1(IN1) ; also sheet 12
I/O_BAC_01: C03.D1(IN2) ; also sheet 12
I/O_BAC_02: C03.F1(IN3) ; also sheet 12
I/O_BAC_03: C03.J1(IN4) ; also sheet 12
I/O_BAC_04: C03.L1(IN5) ; also sheet 12
I/O_BAC_05: C03.N1(IN6) ; also sheet 12
I/O_BAC_06: C03.R1(IN7) ; also sheet 12
I/O_BAC_07: C03.V1(IN8) ; also sheet 12
I/O_BAC_08: C03.E2(IN9) ; also sheet 12
I/O_BAC_09: C03.H2(IN10) ; also sheet 12
I/O_BAC_10: C03.K2(IN11) ; also sheet 12
I/O_BAC_11: C03.M2(IN12) ; also sheet 12
I/O_BMB_00: C02.A1(IN1) ; also sheet 12
I/O_BMB_01: C02.D1(IN2) ; also sheet 12
I/O_BMB_02: C02.F1(IN3) ; also sheet 12
I/O_BMB_03: C02.J1(IN4) ; also sheet 1,12
I/O_BMB_04: C02.L1(IN5) ; also sheet 1,12
I/O_BMB_05: C02.N1(IN6) ; also sheet 1,12
I/O_BMB_06: C02.R1(IN7) ; also sheet 1,12
I/O_BMB_07: C02.V1(IN8) ; also sheet 1,12
I/O_BMB_08: C02.E2(IN9) ; also sheet 1,12
I/O_BMB_09: C02.H2(IN10) ; also sheet 12
I/O_BMB_10: C02.K2(IN11) ; also sheet 12
I/O_BMB_11: C02.M2(IN12) ; also sheet 12
I/O_DATA_IN: B05.J2(E) ; also sheet 12
Unconnected: B03.R2(A) B03.S2(B) B03.T2(C) B03.U2(D) B03.V2(E) B04.R2(A) B04.S2(B) B04.T2(C) B04.U2(D) B04.V2(E) B05.L2(B) B05.P2(E) B05.R2(A) B05.S2(B) B05.T2(C) B05.U2(D) B05.V2(E) C02.P2(IN13) C02.R2(O13) C02.S2(IN14) C02.T2(O14) C03.P2(IN13) C03.R2(O13) C03.S2(IN14) C03.T2(O14) C03.U2(IN15) C03.V2(O15)

## Sheet 12 of 12
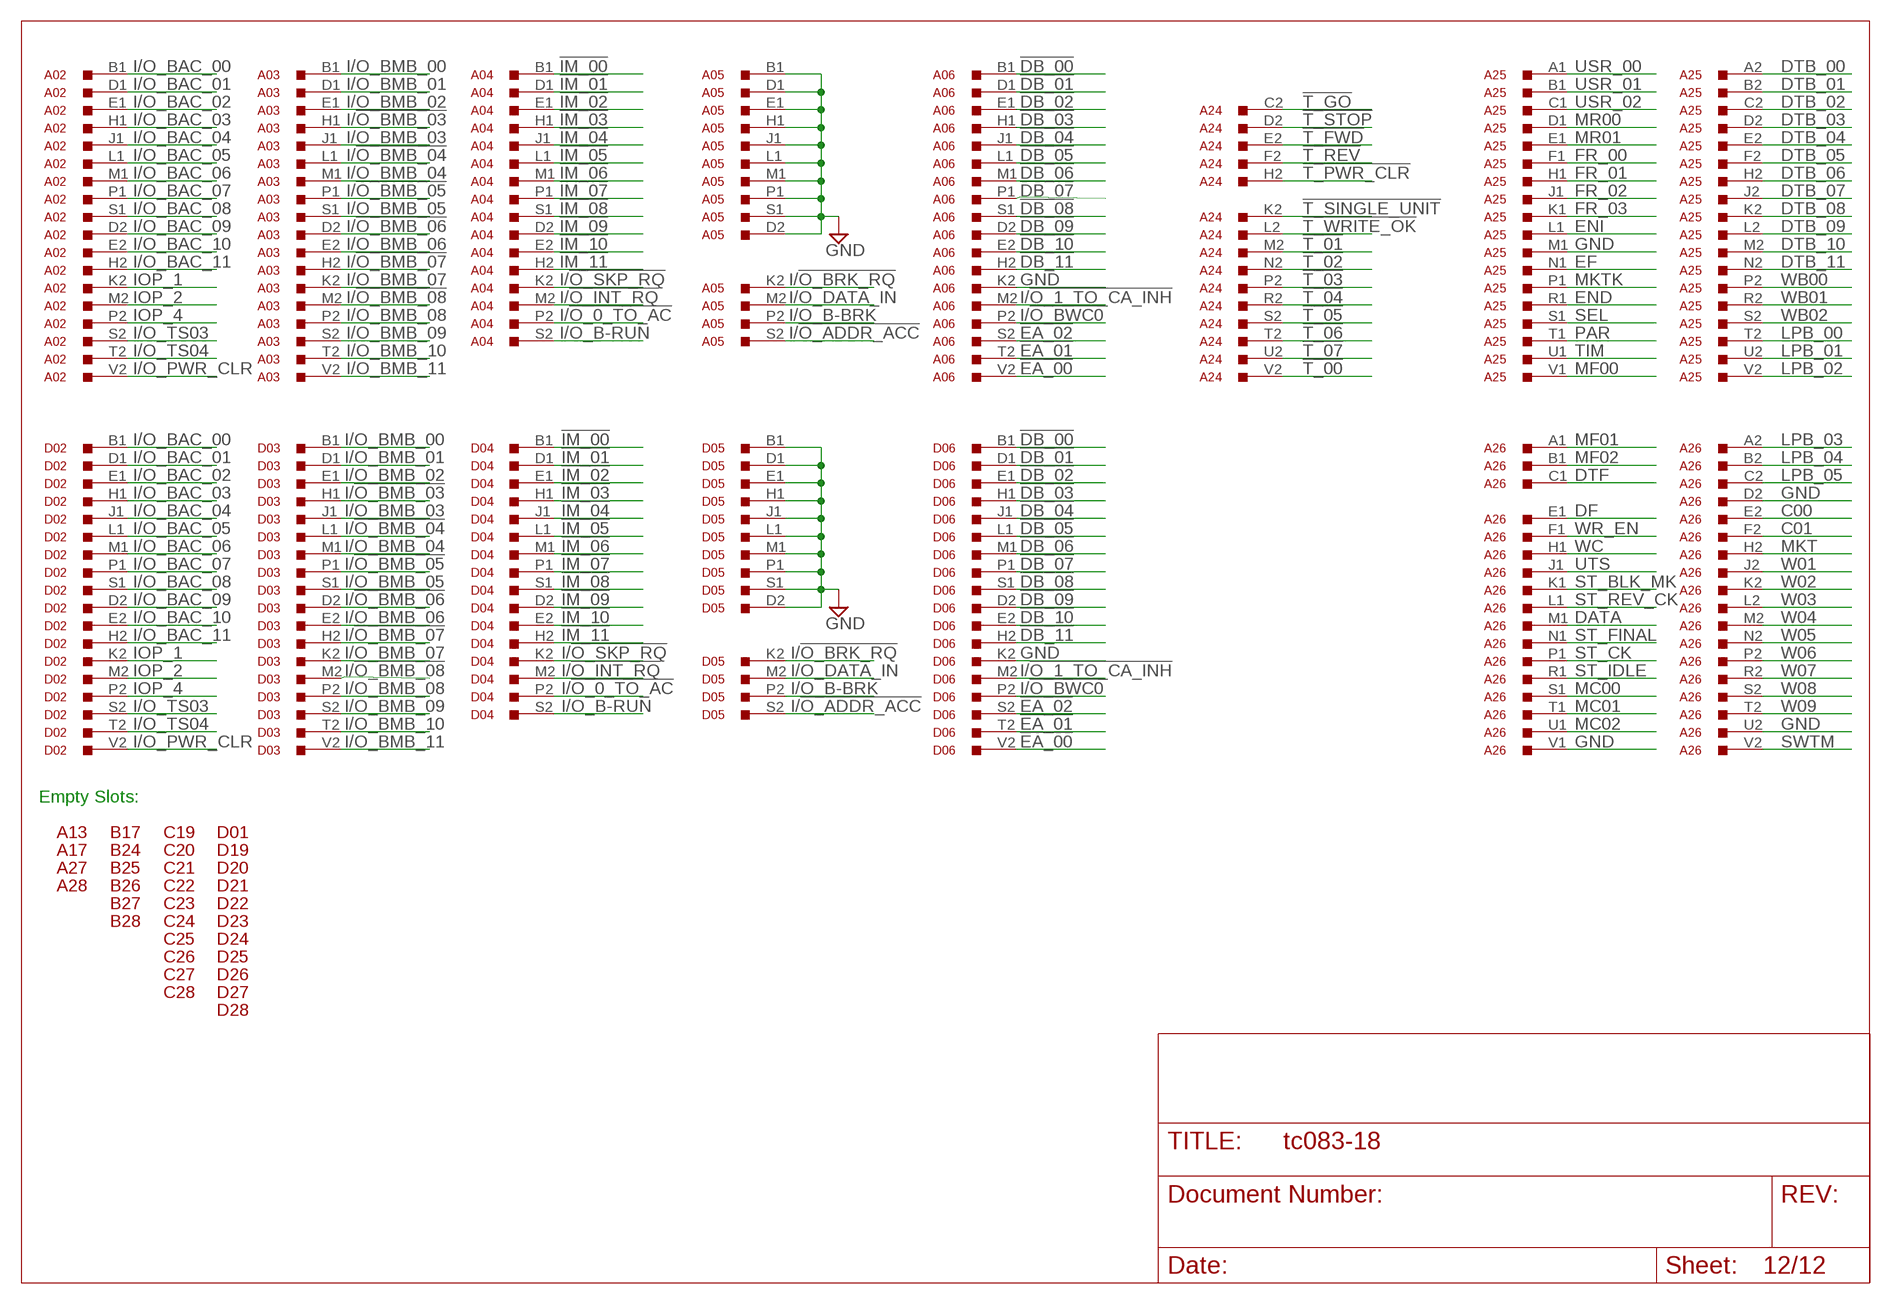
[diagram p11: schematic, sheet 12]

### Parts
A02  M903  [H807]
A03  M903  [H807]
A04  M903  [H807]
A05  M903  [H807]
A06  M903  [H807]
A13  H807  [H807]
A17  H807  [H807]
A24  W023  [H807]
A25  M916  [H807]
A26  M916  [H807]
A27  H807  [H807]
A28  H807  [H807]
B17  H807  [H807]
B24  H807  [H807]
B25  H807  [H807]
B26  H807  [H807]
B27  H807  [H807]
B28  H807  [H807]
C19  H807  [H807]
C20  H807  [H807]
C21  H807  [H807]
C22  H807  [H807]
C23  H807  [H807]
C24  H807  [H807]
C25  H807  [H807]
C26  H807  [H807]
C27  H807  [H807]
C28  H807  [H807]
D01  H807  [H807]
D02  M903  [H807]
D03  M903  [H807]
D04  M903  [H807]
D05  M903  [H807]
D06  M903  [H807]
D19  H807  [H807]
D20  H807  [H807]
D21  H807  [H807]
D22  H807  [H807]
D23  H807  [H807]
D24  H807  [H807]
D25  H807  [H807]
D26  H807  [H807]
D27  H807  [H807]
D28  H807  [H807]

### Nets
!DB_00: A06.B1 D06.B1 ; also sheet 11
!DB_01: A06.D1 D06.D1 ; also sheet 11
!DB_02: A06.E1 D06.E1 ; also sheet 11
!DB_03: A06.H1 D06.H1 ; also sheet 11
!DB_04: A06.J1 D06.J1 ; also sheet 11
!DB_05: A06.L1 D06.L1 ; also sheet 11
!DB_06: A06.M1 D06.M1 ; also sheet 11
!DB_07: A06.P1 D06.P1 ; also sheet 11
!DB_08: A06.S1 D06.S1 ; also sheet 11
!DB_09: A06.D2 D06.D2 ; also sheet 11
!DB_10: A06.E2 D06.E2 ; also sheet 11
!DB_11: A06.H2 D06.H2 ; also sheet 11
!EA_00: A06.V2 D06.V2 ; also sheet 11
!EA_01: A06.T2 D06.T2 ; also sheet 11
!EA_02: A06.S2 D06.S2 ; also sheet 11
!IM_00: A04.B1 D04.B1 ; also sheet 11
!IM_01: A04.D1 D04.D1 ; also sheet 11
!IM_02: A04.E1 D04.E1 ; also sheet 11
!IM_03: A04.H1 D04.H1 ; also sheet 11
!IM_04: A04.J1 D04.J1 ; also sheet 11
!IM_05: A04.L1 D04.L1 ; also sheet 11
!IM_06: A04.M1 D04.M1 ; also sheet 11
!IM_07: A04.P1 D04.P1 ; also sheet 11
!IM_08: A04.S1 D04.S1 ; also sheet 11
!IM_09: A04.D2 D04.D2 ; also sheet 11
!IM_10: A04.E2 D04.E2
!IM_11: A04.H2 D04.H2 ; also sheet 11
!T_00: A24.V2 ; also sheet 2
!T_01: A24.M2 ; also sheet 2
!T_02: A24.N2 ; also sheet 2
!T_03: A24.P2 ; also sheet 2
!T_04: A24.R2 ; also sheet 2
!T_05: A24.S2 ; also sheet 2
!T_06: A24.T2 ; also sheet 2
!T_07: A24.U2 ; also sheet 2
!T_FWD: A24.E2 ; also sheet 2
!T_GO: A24.C2 ; also sheet 2
!T_PWR_CLR: A24.H2 ; also sheet 2
!T_REV: A24.F2 ; also sheet 2
!T_SINGLE_UNIT: A24.K2 ; also sheet 6
!T_STOP: A24.D2 ; also sheet 2
!T_WRITE_OK: A24.L2 ; also sheet 2
C00: A26.E2 ; also sheet 4,5,9
C01: A26.F2 ; also sheet 4,5
DATA: A26.M1 ; also sheet 5,7
DF: A26.E1 ; also sheet 4,6
DTB_00: A25.A2 ; also sheet 8,9
DTB_01: A25.B2 ; also sheet 8,9
DTB_02: A25.C2 ; also sheet 8,9
DTB_03: A25.D2 ; also sheet 8
DTB_04: A25.E2 ; also sheet 8
DTB_05: A25.F2 ; also sheet 8
DTB_06: A25.H2 ; also sheet 8
DTB_07: A25.J2 ; also sheet 8
DTB_08: A25.K2 ; also sheet 8
DTB_09: A25.L2 ; also sheet 8
DTB_10: A25.M2 ; also sheet 8
DTB_11: A25.N2 ; also sheet 8
DTF: A26.C1 ; also sheet 1,4,6
EF: A25.N1 ; also sheet 1,6
END: A25.R1 ; also sheet 6
ENI: A25.L1 ; also sheet 1,2
FR_00: A25.F1 ; also sheet 2,4
FR_01: A25.H1 ; also sheet 1,2,5,6
FR_02: A25.J1 ; also sheet 2
FR_03: A25.K1 ; also sheet 2,5
GND: A05.B1 A05.D1 A05.D2 A05.E1 A05.H1 A05.J1 A05.L1 A05.M1 A05.P1 A05.S1 A06.K2 A25.M1 A26.D2 A26.U2 A26.V1 D05.B1 D05.D1 D05.D2 D05.E1 D05.H1 D05.J1 D05.L1 D05.M1 D05.P1 D05.S1 D06.K2 ; also sheet 1,2,4,10,11
I/!O_0_TO_AC: A04.P2 D04.P2 ; also sheet 11
I/!O_1_TO_CA_INH: A06.M2 D06.M2 ; also sheet 11
I/!O_ADDR_ACC: A05.S2 D05.S2 ; also sheet 11
I/!O_BMB_03: A03.H1 D03.H1
I/!O_BMB_04: A03.L1 D03.L1
I/!O_BMB_05: A03.P1 D03.P1
I/!O_BMB_06: A03.D2 D03.D2
I/!O_BMB_07: A03.H2 D03.H2
I/!O_BMB_08: A03.M2 D03.M2 ; also sheet 1
I/!O_BRK_RQ: A05.K2 D05.K2 ; also sheet 11
I/!O_BWC0: A06.P2 D06.P2 ; also sheet 1
I/!O_INT_RQ: A04.M2 D04.M2 ; also sheet 11
I/!O_SKP_RQ: A04.K2 D04.K2 ; also sheet 11
I/O_B-BRK: A05.P2 D05.P2 ; also sheet 1
I/O_B-RUN: A04.S2 D04.S2 ; also sheet 1
I/O_BAC_00: A02.B1 D02.B1 ; also sheet 11
I/O_BAC_01: A02.D1 D02.D1 ; also sheet 11
I/O_BAC_02: A02.E1 D02.E1 ; also sheet 11
I/O_BAC_03: A02.H1 D02.H1 ; also sheet 11
I/O_BAC_04: A02.J1 D02.J1 ; also sheet 11
I/O_BAC_05: A02.L1 D02.L1 ; also sheet 11
I/O_BAC_06: A02.M1 D02.M1 ; also sheet 11
I/O_BAC_07: A02.P1 D02.P1 ; also sheet 11
I/O_BAC_08: A02.S1 D02.S1 ; also sheet 11
I/O_BAC_09: A02.D2 D02.D2 ; also sheet 11
I/O_BAC_10: A02.E2 D02.E2 ; also sheet 11
I/O_BAC_11: A02.H2 D02.H2 ; also sheet 11
I/O_BMB_00: A03.B1 D03.B1 ; also sheet 11
I/O_BMB_01: A03.D1 D03.D1 ; also sheet 11
I/O_BMB_02: A03.E1 D03.E1 ; also sheet 11
I/O_BMB_03: A03.J1 D03.J1 ; also sheet 1,11
I/O_BMB_04: A03.M1 D03.M1 ; also sheet 1,11
I/O_BMB_05: A03.S1 D03.S1 ; also sheet 1,11
I/O_BMB_06: A03.E2 D03.E2 ; also sheet 1,11
I/O_BMB_07: A03.K2 D03.K2 ; also sheet 1,11
I/O_BMB_08: A03.P2 D03.P2 ; also sheet 1,11
I/O_BMB_09: A03.S2 D03.S2 ; also sheet 11
I/O_BMB_10: A03.T2 D03.T2 ; also sheet 11
I/O_BMB_11: A03.V2 D03.V2 ; also sheet 11
I/O_DATA_IN: A05.M2 D05.M2 ; also sheet 11
I/O_PWR_CLR: A02.V2 D02.V2 ; also sheet 1
I/O_TS03: A02.S2 D02.S2 ; also sheet 1
I/O_TS04: A02.T2 D02.T2
IOP_1: A02.K2 D02.K2 ; also sheet 1
IOP_2: A02.M2 D02.M2 ; also sheet 1
IOP_4: A02.P2 D02.P2 ; also sheet 1
LPB_00: A25.T2 ; also sheet 8,9
LPB_01: A25.U2 ; also sheet 8,9
LPB_02: A25.V2 ; also sheet 8,9
LPB_03: A26.A2 ; also sheet 8,9
LPB_04: A26.B2 ; also sheet 8,9
LPB_05: A26.C2 ; also sheet 8,9
MC00: A26.S1 ; also sheet 4
MC01: A26.T1 ; also sheet 4,6
MC02: A26.U1 ; also sheet 4,5,9
MF00: A25.V1 ; also sheet 1
MF01: A26.A1 ; also sheet 1
MF02: A26.B1 ; also sheet 1
MKT: A26.H2 ; also sheet 4,5,9
MKTK: A25.P1 ; also sheet 6
MR00: A25.D1 ; also sheet 2
MR01: A25.E1 ; also sheet 2,3
PAR: A25.T1 ; also sheet 6
SEL: A25.S1 ; also sheet 6
ST_BLK_MK: A26.K1 ; also sheet 5,7
ST_CK: A26.P1 ; also sheet 4,5,6,7
ST_FINAL: A26.N1 ; also sheet 4,5,7,9
ST_IDLE: A26.R1 ; also sheet 5,7
ST_REV_CK: A26.L1 ; also sheet 4,5,7,9
SWTM: A26.V2 ; also sheet 3,5,6
TIM: A25.U1 ; also sheet 6
USR_00: A25.A1 ; also sheet 2
USR_01: A25.B1 ; also sheet 2
USR_02: A25.C1 ; also sheet 2
UTS: A26.J1 ; also sheet 3,5
W01: A26.J2 ; also sheet 7
W02: A26.K2 ; also sheet 7
W03: A26.L2 ; also sheet 7
W04: A26.M2 ; also sheet 7
W05: A26.N2 ; also sheet 7
W06: A26.P2 ; also sheet 7
W07: A26.R2 ; also sheet 7
W08: A26.S2 ; also sheet 7
W09: A26.T2 ; also sheet 7
WB00: A25.P2 ; also sheet 8,9,10
WB01: A25.R2 ; also sheet 8,9,10
WB02: A25.S2 ; also sheet 8,9,10
WC: A26.H1 ; also sheet 1,4,5
WR_EN: A26.F1 ; also sheet 3,5,9,10
Unconnected: A04.T2 A04.V2 A05.E2 A05.H2 A05.T2 A05.V2 A24.A2 A24.B2 A24.J2 A26.D1 D04.T2 D04.V2 D05.E2 D05.H2 D05.T2 D05.V2

### Notes on the sheet
- Empty Slots:

## Power pins joined to a net without a drawn wire
-15V: A18.B2(-15V) A20.B2(-15V) A21.B2(-15V) A22.B2(-15V) A23.B2(-15V) B18.B2(-15V) B20.B2(-15V) B21.B2(-15V) B22.B2(-15V) B23.B2
GND: A02.A1 A02.C1 A02.C2 A02.F1 A02.F2 A02.J2 A02.K1 A02.L2 A02.N1 A02.N2 A02.R1 A02.R2 A02.T1 A02.U2 A03.A1 A03.C1 A03.C2 A03.F1 A03.F2 A03.J2 A03.K1 A03.L2 A03.N1 A03.N2 A03.R1 A03.R2 A03.T1 A03.U2 A04.A1 A04.C1 A04.C2 A04.F1 A04.F2 A04.J2 A04.K1 A04.L2 A04.N1 A04.N2 A04.R1 A04.R2 A04.T1 A04.U2 A05.A1 A05.C1 A05.C2 A05.F1 A05.F2 A05.J2 A05.K1 A05.L2 A05.N1 A05.N2 A05.R1 A05.R2 A05.T1 A05.U2 A06.A1 A06.C1 A06.C2 A06.F1 A06.F2 A06.J2 A06.K1 A06.L2 A06.N1 A06.N2 A06.R1 A06.R2 A06.T1 A06.U2 A07.C2(GND) A07.T1(GND) A08.C2(GND) A08.T1(GND) A09.C2(GND) A09.T1(GND) A10.B2(GND) A10.T1(GND) A11.C2(GND) A11.T1(GND) A12.B2(GND) A12.T1(GND) A14.C2(GND) A14.T1(GND) A15.C2(GND) A15.T1(GND) A16.C2(GND) A16.T1(GND) A18.C2(GND) A20.C2(GND) A21.C2(GND) A22.C2(GND) A22.M2(GND) A23.C2(GND) A23.T1(GND) A23.U1(GND) A23.V1(GND) AB19.AC2 AB19.AK2 AB19.AS2 AB19.AT2 AB19.BE2 AB19.BL2 B02.C2(GND) B02.T1(GND) B02.U1(GND) B02.V1(GND) B03.C2(GND) B03.T1(GND) B03.U1(GND) B03.V1(GND) B04.C2(GND) B04.T1(GND) B04.U1(GND) B04.V1(GND) B05.C2(GND) B05.T1(GND) B05.U1(GND) B05.V1(GND) B06.C2(GND) B06.T1(GND) B07.C2(GND) B07.T1(GND) B08.B2(GND) B08.T1(GND) B09.C2(GND) B09.T1(GND) B10.C2(GND) B10.T1(GND) B11.C2(GND) B11.T1(GND) B12.C2(GND) B12.T1(GND) B13.C2(GND) B13.T1(GND) B14.C2(GND) B14.T1(GND) B15.B2(GND) B15.T1(GND) B16.C2(GND) B16.T1(GND) B18.C2(GND) B20.C2(GND) B21.C2(GND) B22.C2(GND) B22.T1(GND) B22.U1(GND) B22.V1(GND) B23.C2 C01.C2(GND) C01.T1(GND) C02.C2(GND) C02.T1(GND) C03.C2(GND) C03.T1(GND) C04.C2(GND) C04.T1(GND) C05.C2(GND) C05.T1(GND) C06.C2(GND) C06.T1(GND) C07.C2(GND) C07.T1(GND) C08.C2(GND) C08.T1(GND) C09.C2(GND) C09.T1(GND) C10.C2(GND) C10.T1(GND) C11.B2(GND) C11.T1(GND) C12.C2(GND) C12.T1(GND) C13.C2(GND) C13.T1(GND) C14.C2(GND) C14.T1(GND) C15.B2(GND) C15.T1(GND) C16.C2(GND) C16.T1(GND) C17.C2(GND) C17.T1(GND) CD18.AC2(GND) CD18.AT1(GND) CD18.BC2(GND) CD18.BT1(GND) D02.A1 D02.C1 D02.C2 D02.F1 D02.F2 D02.J2 D02.K1 D02.L2 D02.N1 D02.N2 D02.R1 D02.R2 D02.T1 D02.U2 D03.A1 D03.C1 D03.C2 D03.F1 D03.F2 D03.J2 D03.K1 D03.L2 D03.N1 D03.N2 D03.R1 D03.R2 D03.T1 D03.U2 D04.A1 D04.C1 D04.C2 D04.F1 D04.F2 D04.J2 D04.K1 D04.L2 D04.N1 D04.N2 D04.R1 D04.R2 D04.T1 D04.U2 D05.A1 D05.C1 D05.C2 D05.F1 D05.F2 D05.J2 D05.K1 D05.L2 D05.N1 D05.N2 D05.R1 D05.R2 D05.T1 D05.U2 D06.A1 D06.C1 D06.C2 D06.F1 D06.F2 D06.J2 D06.K1 D06.L2 D06.N1 D06.N2 D06.R1 D06.R2 D06.T1 D06.U2 D07.C2(GND) D07.T1(GND) D08.C2(GND) D08.T1(GND) D09.C2(GND) D09.T1(GND) D10.C2(GND) D10.T1(GND) D11.C2(GND) D11.T1(GND) D12.C2(GND) D12.T1(GND) D13.C2(GND) D13.T1(GND) D14.C2(GND) D14.T1(GND) D15.C2(GND) D15.T1(GND) D16.C2(GND) D16.T1(GND) D17.C2(GND) D17.T1(GND)
VCC: A07.A2(VCC) A08.A2(VCC) A09.A2(VCC) A10.A2(VCC) A11.A2(VCC) A12.A2(VCC) A14.A2(VCC) A15.A2(VCC) A16.A2(VCC) A18.A2(VCC) A20.A2(VCC) A21.A2(VCC) A22.A2(VCC) A23.A2(VCC) B02.A2(VCC) B03.A2(VCC) B04.A2(VCC) B05.A2(VCC) B06.A2(VCC) B07.A2(VCC) B08.A2(VCC) B09.A2(VCC) B10.A2(VCC) B11.A2(VCC) B12.A2(VCC) B13.A2(VCC) B14.A2(VCC) B15.A2(VCC) B16.A2(VCC) B18.A2(VCC) B20.A2(VCC) B21.A2(VCC) B22.A2(VCC) C01.A2(VCC) C02.A2(VCC) C03.A2(VCC) C04.A2(VCC) C05.A2(VCC) C06.A2(VCC) C07.A2(VCC) C08.A2(VCC) C09.A2(VCC) C10.A2(VCC) C11.A2(VCC) C12.A2(VCC) C13.A2(VCC) C14.A2(VCC) C15.A2(VCC) C16.A2(VCC) C17.A2(VCC) CD18.AA2(VCC) CD18.BA2(VCC) D07.A2(VCC) D08.A2(VCC) D09.A2(VCC) D10.A2(VCC) D11.A2(VCC) D12.A2(VCC) D13.A2(VCC) D14.A2(VCC) D15.A2(VCC) D16.A2(VCC) D17.A2(VCC)